# Altium project GargantuRAM_1_5_PRE_GITHUB.PrjPcb (part 1 of 3)
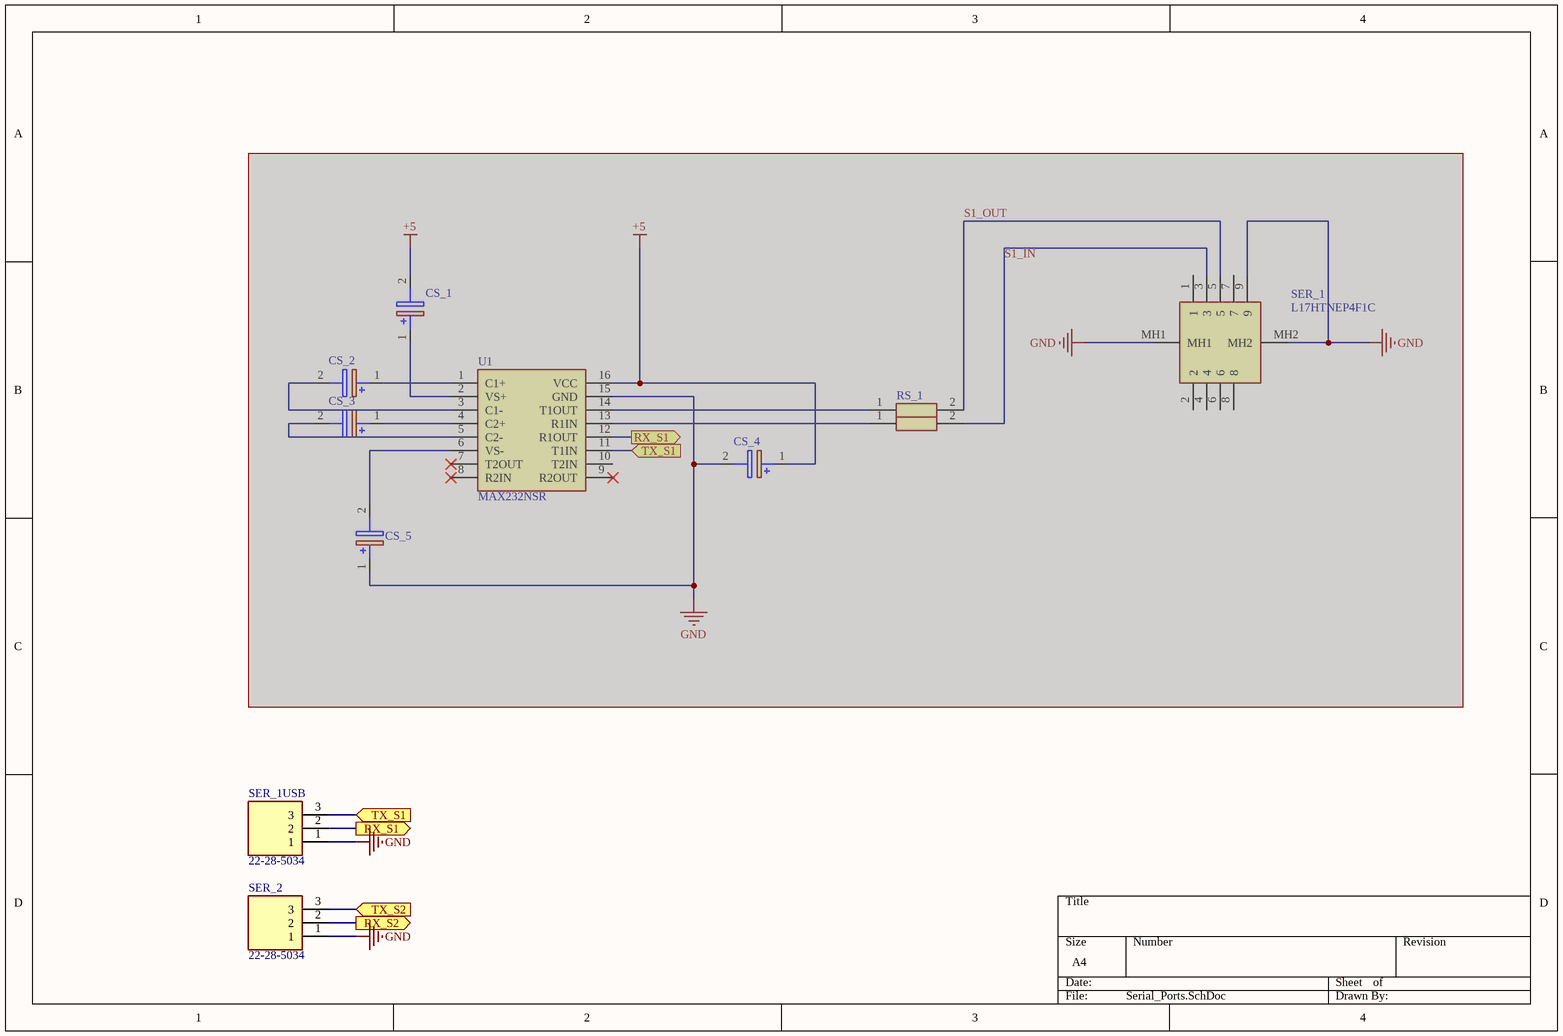
[diagram p0: Serial_Ports.SchDoc]
11 sheets, 300 parts. Net scope: flat (ports and power ports of the same name join across sheets).
Board file: MainBoard_6_layers.PcbDoc
Sheets:
  Serial_Ports.SchDoc
  ROM.SchDoc
  Power.SchDoc
  Ethernet.SchDoc
  CPU_and_EXPANSION_BUS.SchDoc
  SD_RTC_SPI.SchDoc
  RAM.SchDoc
  FPGA.SchDoc
  AddressBUS.SchDoc
  Clock.SchDoc
  DataBUS.SchDoc

## Sheet Serial_Ports.SchDoc
size A4; SheetNumber: 1; SheetTotal: 12

### Parts
CS_1  EDH105M050A9BAA  [CAPAE430X565N]  (value not drawn)  (masked out: inside a compile mask, not in the netlist)
CS_2  EDH105M050A9BAA  [CAPAE430X565N]  (value not drawn)  (masked out: inside a compile mask, not in the netlist)
CS_3  EDH105M050A9BAA  [CAPAE430X565N]  (value not drawn)  (masked out: inside a compile mask, not in the netlist)
CS_4  EDH105M050A9BAA  [CAPAE430X565N]  (value not drawn)  (masked out: inside a compile mask, not in the netlist)
CS_5  EDH105M050A9BAA  [CAPAE430X565N]  (value not drawn)  (masked out: inside a compile mask, not in the netlist)
RS_1  RCC0805100RFKEA  [RCC0805_e3]  (value not drawn)  (masked out: inside a compile mask, not in the netlist)
RS_2  RCC0805100RFKEA  [RCC0805_e3]  (value not drawn)  (masked out: inside a compile mask, not in the netlist)
SER_1  L17HTNEP4F1C  [L17HTNEP4F1C]  (masked out: inside a compile mask, not in the netlist)
SER_1USB  22-28-5034  [HDRV3W66P0X254_1X3_1016X249X1042P]
SER_2  22-28-5034  [HDRV3W66P0X254_1X3_1016X249X1042P]
U1  MAX232NSR  [SOIC127P780X200-16N]  (masked out: inside a compile mask, not in the netlist)

### Ports
RX_S1 (out), RX_S2 (out), TX_S1 (in), TX_S2 (in)

### Nets
GND: SER_1USB.1 SER_2.1
RX_S1: SER_1USB.2 ; port RX_S1
RX_S2: SER_2.2 ; port RX_S2
TX_S1: SER_1USB.3 ; port TX_S1
TX_S2: SER_2.3 ; port TX_S2

### Library data of the parts
CS_1-CS_5 = EDH105M050A9BAA: Capacitor Polarised; Manufacturer_Name: KEMET; Datasheet Link: https://content.kemet.com/datasheets/KEM_A4049_EDH.pdf; Height: 5.65mm; Manufacturer_Part_Number: EDH105M050A9BAA; Mouser Part Number: 80-EDH105M050A9BAA; Mouser Price/Stock: https://www.mouser.co.uk/ProductDetail/KEMET/EDH105M050A9BAA?qs=E9QF1UCAUX56DBSFGzxVeg%3D%3D; Arrow Part Number: EDH105M050A9BAA; Arrow Price/Stock: https://www.arrow.com/en/products/edh105m050a9baa/kemet-corporation?region=europe
RS_1 RS_2 = RCC0805100RFKEA: Resistor; Manufacturer_Name: Vishay; Datasheet Link: https://www.vishay.com/docs/20066/rcce3.pdf; Height: 0.5mm; Manufacturer_Part_Number: RCC0805100RFKEA; Mouser Part Number: 71-RCC0805100RFKEA; Mouser Price/Stock: https://www.mouser.co.uk/ProductDetail/Vishay-Dale/RCC0805100RFKEA?qs=GedFDFLaBXHpeG221Izd5g%3D%3D; Arrow Part Number: RCC0805100RFKEA; Arrow Price/Stock: https://www.arrow.com/en/products/rcc0805100rfkea/vishay?region=nac
SER_1 = L17HTNEP4F1C: Connector; Manufacturer_Name: Amphenol Communications Solutions; Datasheet Link: https://cdn.amphenol-cs.com/media/wysiwyg/files/drawing/l17htnxp4fxc.pdf; Height: 12.55mm; Manufacturer_Part_Number: L17HTNEP4F1C; Mouser Part Number: 523-L17HTNEP4F1C; Mouser Price/Stock: https://www.mouser.co.uk/ProductDetail/Amphenol-Commercial-Products/L17HTNEP4F1C?qs=U9AFyCBc0MwQlSlNY0N8tQ%3D%3D
SER_1USB SER_2 = 22-28-5034: Connector; Manufacturer_Name: Molex; Datasheet Link: https://componentsearchengine.com/Datasheets/2/22-28-5034.pdf; Height: 10.42mm; Manufacturer_Part_Number: 22-28-5034; Mouser Part Number: 538-22-28-5034; Mouser Price/Stock: https://www.mouser.co.uk/ProductDetail/Molex/22-28-5034?qs=l%252BWx29wYPrxAp9jaws3tbA%3D%3D
U1 = MAX232NSR: Integrated Circuit; Manufacturer_Name: Texas Instruments; Datasheet Link: http://www.ti.com/general/docs/lit/getliterature.tsp?genericPartNumber=MAX232&fileType=pdf&HQS=ti-null-null-sf-df-pf-sep-wwe&DCM=yes; Height: 2mm; Manufacturer_Part_Number: MAX232NSR; Mouser Part Number: 595-MAX232NSR; Mouser Price/Stock: https://www.mouser.co.uk/ProductDetail/Texas-Instruments/MAX232NSR?qs=paYhMW8qfiuOrkdV8Ubirw%3D%3D; Arrow Part Number: MAX232NSR; Arrow Price/Stock: https://www.arrow.com/en/products/max232nsr/texas-instruments?region=nac

## Sheet ROM.SchDoc
size A4; SheetNumber: 2; SheetTotal: 11
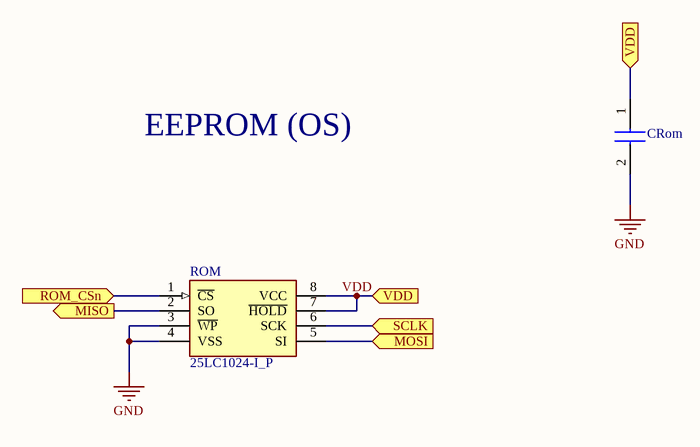
[diagram p1: ROM.SchDoc]

### Parts
CRom  GRM155R71C104JA88D  [CAPC1005X55N]  (value not drawn)
ROM  25LC1024-I_P  [DIP781W56P254L950H533Q8N]

### Ports
MISO (out), MOSI (in), ROM_CSn (in), SCLK (in), VDD (in)

### Nets
GND: CRom.2 ROM.3(~{WP}) ROM.4(VSS)
MISO: ROM.2(SO) ; port MISO
MOSI: ROM.5(SI) ; port MOSI
ROM_CSn: ROM.1(~{CS}) ; port ROM_CSn
SCLK: ROM.6(SCK) ; port SCLK
VDD: CRom.1 ROM.7(~{HOLD}) ROM.8(VCC) ; port VDD

### Notes on the sheet
- EEPROM (OS)

### Library data of the parts
CRom = GRM155R71C104JA88D: Capacitor; Manufacturer_Name: Murata Electronics; Datasheet Link: http://www.murata.com/~/media/webrenewal/support/library/catalog/products/capacitor/mlcc/c02e.pdf; Height: 0.55mm; Manufacturer_Part_Number: GRM155R71C104JA88D; Mouser Part Number: 81-GRM155R71C104JA8D; Mouser Price/Stock: https://www.mouser.co.uk/ProductDetail/Murata-Electronics/GRM155R71C104JA88D?qs=pwh76yelNxDjPOceoz6xEg%3D%3D; Arrow Part Number: GRM155R71C104JA88D; Arrow Price/Stock: https://www.arrow.com/en/products/grm155r71c104ja88d/murata-manufacturing?region=nac
ROM = 25LC1024-I_P: Integrated Circuit; Manufacturer_Name: Microchip; Manufacturer_Part_Number: 25LC1024-I/P; Datasheet Link: http://ww1.microchip.com/downloads/en/DeviceDoc/22064D.pdf; Height: 5.334mm; Mouser Part Number: 579-25LC1024-I/P; Mouser Price/Stock: https://www.mouser.co.uk/ProductDetail/Microchip-Technology/25LC1024-I-P?qs=W2ndVjZwIII4HC8C0OcyMA%3D%3D; Arrow Part Number: 25LC1024-I/P; Arrow Price/Stock: https://www.arrow.com/en/products/25lc1024-ip/microchip-technology

## Sheet Power.SchDoc
size A3; SheetNumber: 3; SheetTotal: 12
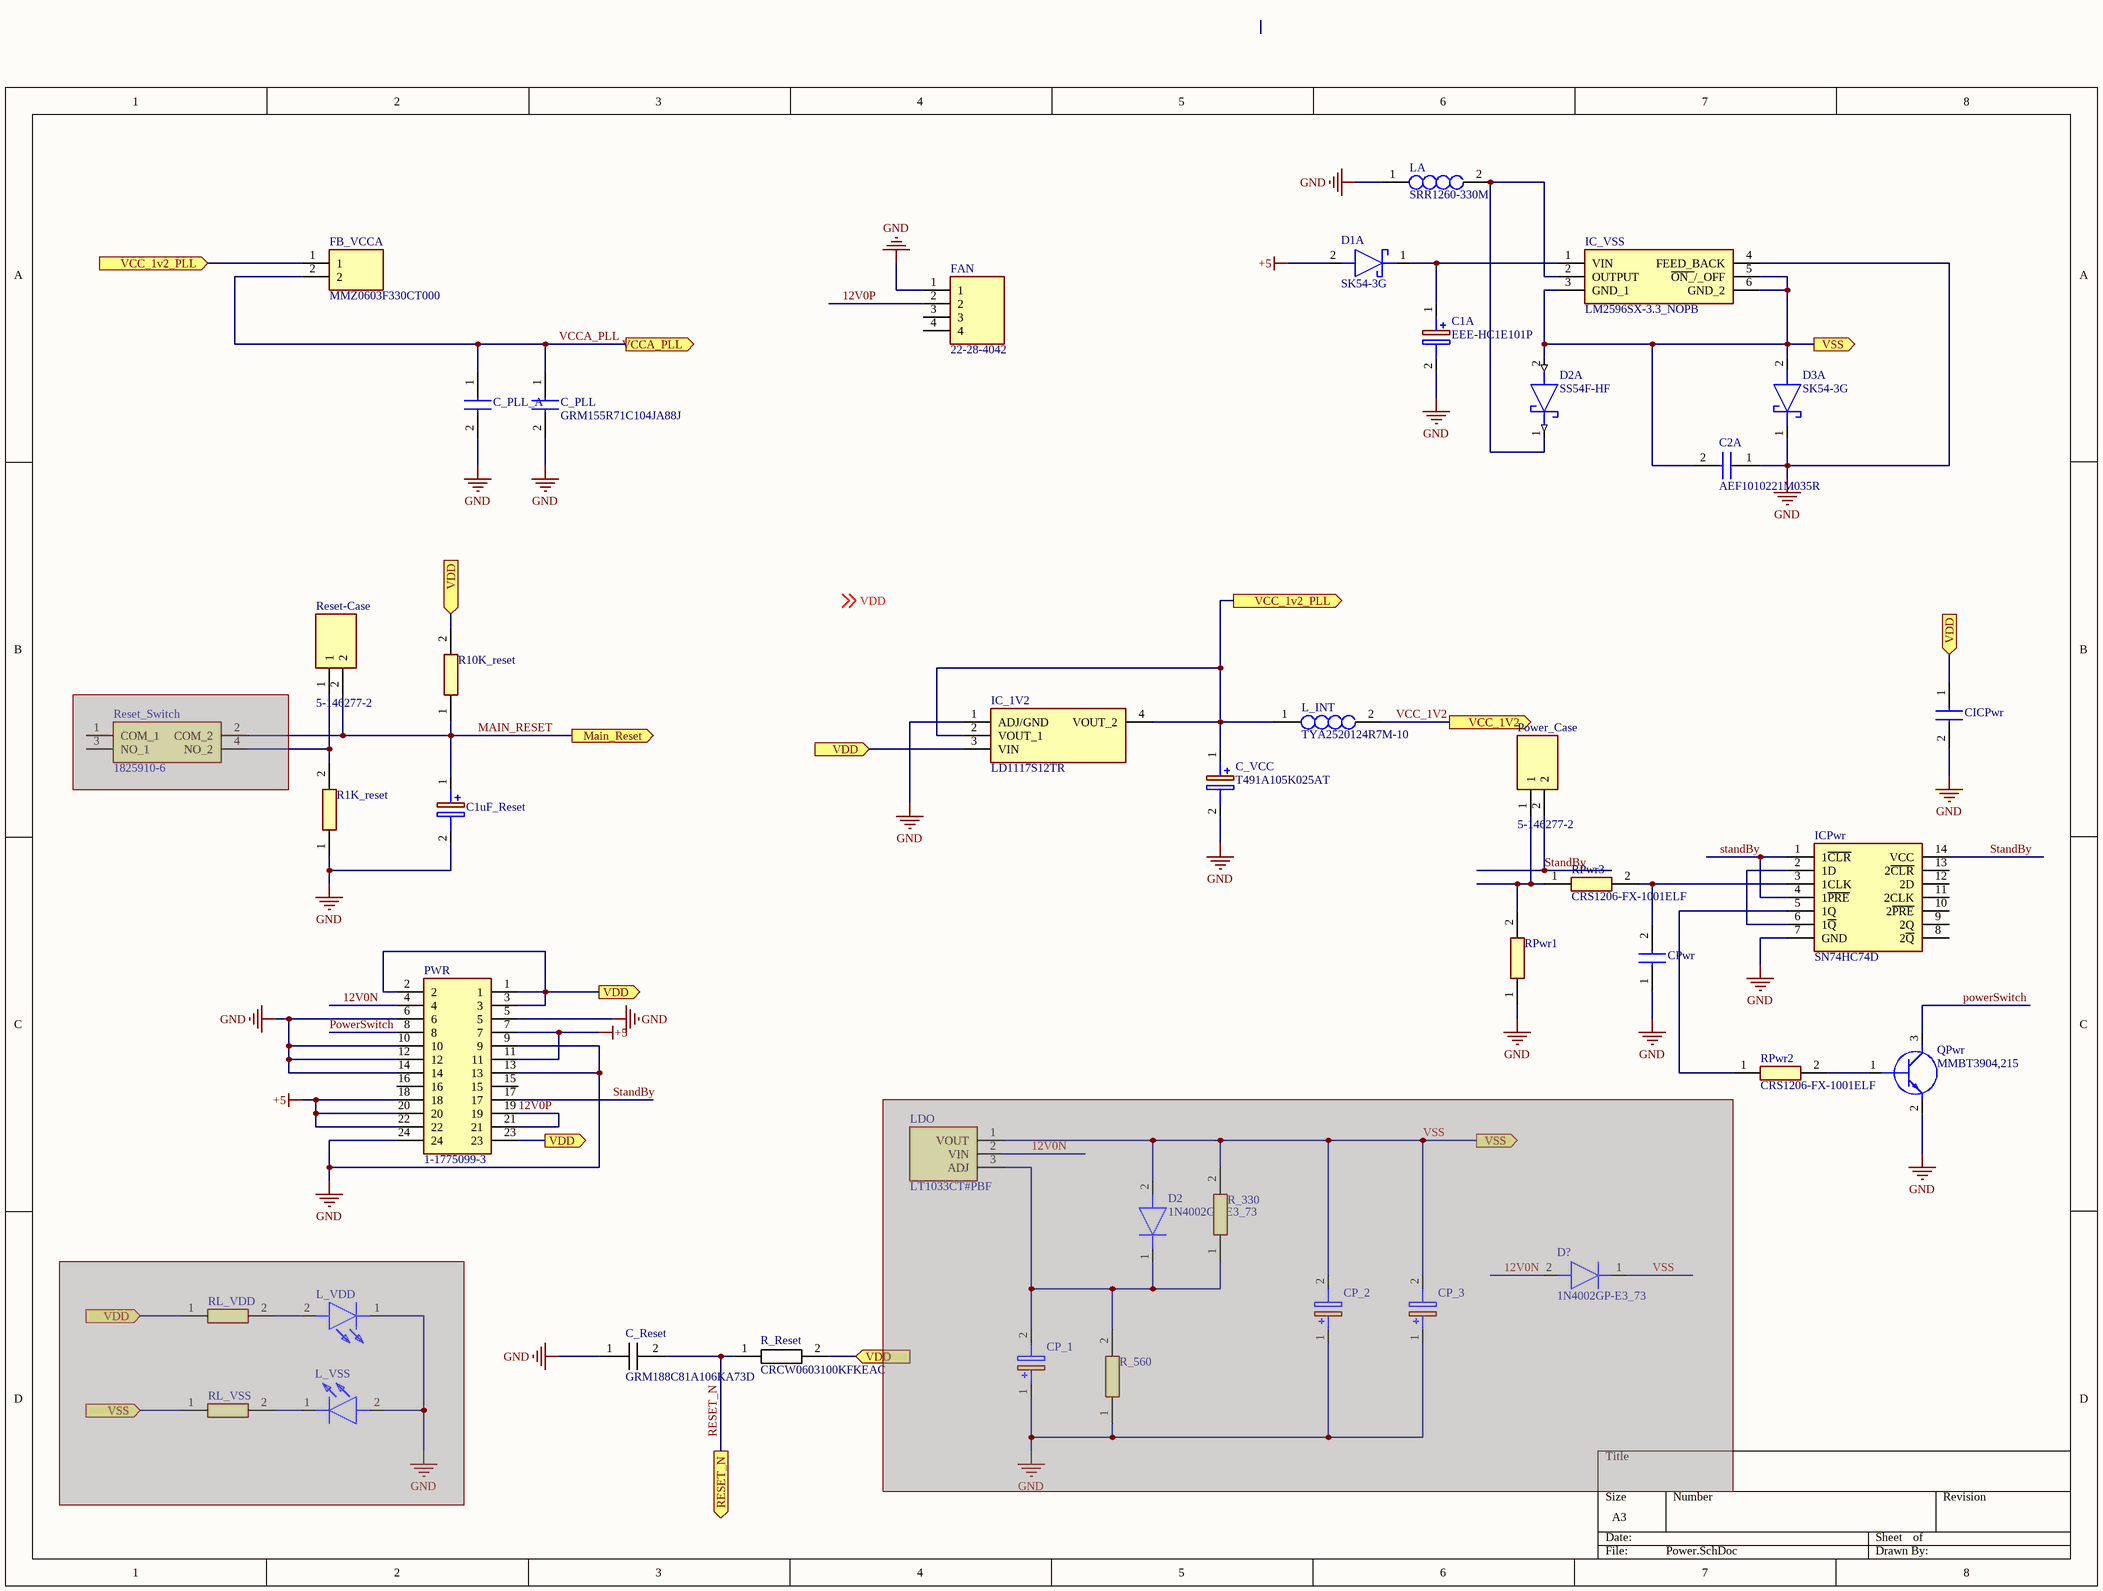
[diagram p2: Power.SchDoc]

### Parts
C1A  EEE-HC1E101P  [EEHZT1E331UP]
C1uF_Reset  EDH105M050A9BAA  [CAPAE430X565N]  (value not drawn)
C2A  AEF1010221M035R  [CAPAE1030X1050N]
C_PLL  GRM155R71C104JA88J  [CAPC1005X55N]
C_PLL_A  C0805X475J3RACAUTO7210  [CAPC2012X145N]  (value not drawn)
C_Reset  GRM188C81A106KA73D  [CAPC1608X90N]
C_VCC  T491A105K025AT  [T491A]
CICPwr  GRM155R71C104JA88D  [CAPC1005X55N]  (value not drawn)
CP_1  860020472003  [CAPPRD200W52D500H1250]  (value not drawn)  (masked out: inside a compile mask, not in the netlist)
CP_2  TAP225K035CRW  [TAP225K035CRW]  (value not drawn)  (masked out: inside a compile mask, not in the netlist)
CP_3  ECA-1EM102  [CAPPRD500W65D1025H2200]  (value not drawn)  (masked out: inside a compile mask, not in the netlist)
CPwr  C0603X103G5JACTU  [C0603]  (value not drawn)
D1A  SK54-3G  [DIOM5437X240N]
D2  1N4002GP-E3_73  [DIOAD1405W86L465D235]  (masked out: inside a compile mask, not in the netlist)
D2A  SS54F-HF  [SODFL4626X120N]
D3A  SK54-3G  [DIOM5437X240N]
D?  1N4002GP-E3_73  [DIOAD1405W86L465D235]  (masked out: inside a compile mask, not in the netlist)
FAN  22-28-4042  [HDRV4W66P0X254_1X4_1016X249X1003P]
FB_VCCA  MMZ0603F330CT000  [BEADC0603X33N]
IC_1V2  LD1117S12TR  [SOT230P700X180-4N]
IC_VSS  LM2596SX-3.3_NOPB  [KTT0005B]
ICPwr  SN74HC74D  [SOIC127P600X175-14N]
L_INT  TYA2520124R7M-10  [TYA2520124R7M10]
L_VDD  150060VS55040  [LEDM168X50N]  (value not drawn)  (masked out: inside a compile mask, not in the netlist)
L_VSS  150060SS75003  [150060SS75003]  (value not drawn)  (masked out: inside a compile mask, not in the netlist)
LA  SRR1260-330M  [SRR1260-150M]
LDO  LT1033CT#PBF  [TO254P457X1022X2266-3P]  (masked out: inside a compile mask, not in the netlist)
Power_Case  5-146277-2  [HDRV2W67P0X254_1X2_467X234X823P]
PWR  1-1775099-3  [1-1775099-3]
QPwr  MMBT3904,215  [MMBT3904215]
R1K_reset  RCS06031K00FKEA  [RESC1608X50N]  (value not drawn)
R10K_reset  RCS060310K0JNEA  [RCS0603_E3]  (value not drawn)
R_330  OK3315E-R52  [RESAD1680W64L680D250]  (value not drawn)  (masked out: inside a compile mask, not in the netlist)
R_560  OK5615E-R52  [RESAD1680W64L680D250]  (value not drawn)  (masked out: inside a compile mask, not in the netlist)
R_Reset  CRCW0603100KFKEAC  [RESC1608X55N]
Reset-Case  5-146277-2  [HDRV2W67P0X254_1X2_467X234X823P]
Reset_Switch  1825910-6  [18259106]  (masked out: inside a compile mask, not in the netlist)
RL_VDD  CRCW06031K00JNEAC  [RESC1608X55N]  (value not drawn)  (masked out: inside a compile mask, not in the netlist)
RL_VSS  CRCW06031K00JNEAC  [RESC1608X55N]  (value not drawn)  (masked out: inside a compile mask, not in the netlist)
RPwr1  CRS1206QFX-1002ELF  [RESC3116X65N]  (value not drawn)
RPwr2  CRS1206-FX-1001ELF  [RESC3116X65N]
RPwr3  CRS1206-FX-1001ELF  [RESC3116X65N]

### Ports
Main_Reset (out), RESET_N (out), VCC_1V2 (out), VCC_1v2_PLL (in), VCC_1v2_PLL (out), VCCA_PLL (out), VDD (in), VDD (out), VSS (in), VSS (out)

### Nets
+5: D1A.2(A) PWR.7 PWR.11 PWR.18 PWR.20 PWR.22
GND: C1A.2(-) C1uF_Reset.2(-) C2A.1(+) C_PLL.2 C_PLL_A.2 C_Reset.1 C_VCC.2(-) CICPwr.2 CPwr.1 D3A.1(K) FAN.1 IC_1V2.1(ADJ/GND) IC_VSS.4(FEED_BACK) ICPwr.7(GND) LA.1 PWR.5 PWR.6 PWR.9 PWR.10 PWR.12 PWR.13 PWR.14 PWR.24 QPwr.2(E) R1K_reset.1 RPwr1.1
12V0N: PWR.4
12V0P: FAN.2 PWR.19 PWR.21
MAIN_RESET: C1uF_Reset.1(+) R10K_reset.1 Reset-Case.2 ; port Main_Reset
PowerSwitch: PWR.8 QPwr.3(C)
RESET_N: C_Reset.2 R_Reset.1 ; port RESET_N
StandBy: ICPwr.1(1~{CLR}) ICPwr.4(1~{PRE}) ICPwr.14(VCC) Power_Case.2 PWR.17
VCC_1V2: L_INT.2 ; port VCC_1V2
VCCA_PLL: C_PLL.1 C_PLL_A.1 FB_VCCA.2 ; port VCCA_PLL
VDD: CICPwr.1 IC_1V2.3(VIN) PWR.1 PWR.2 PWR.3 PWR.23 R10K_reset.2 R_Reset.2 ; port VDD
VSS: C2A.2(-) D2A.2(A) D3A.2(A) IC_VSS.3(GND_1) IC_VSS.5(~{ON_}/_OFF) IC_VSS.6(GND_2) ; port VSS
NetC1A_1: C1A.1(+) D1A.1(K) IC_VSS.1(VIN)
NetC_VCC_1: C_VCC.1(+) FB_VCCA.1 IC_1V2.2(VOUT_1) IC_1V2.4(VOUT_2) L_INT.1 ; port VCC_1v2_PLL
NetCPwr_2: CPwr.2 ICPwr.3(1CLK) RPwr3.2
NetD2A_1: D2A.1(K) IC_VSS.2(OUTPUT) LA.2
NetICPwr_2: ICPwr.2(1D) ICPwr.6(1~{Q})
NetICPwr_5: ICPwr.5(1Q) RPwr2.1
NetPower_Case_1: Power_Case.1 RPwr1.2 RPwr3.1
NetQPwr_1: QPwr.1(B) RPwr2.2
NetR1K_reset_2: R1K_reset.2 Reset-Case.1

Not connected (* = marked no-connect by the designer): FAN 3 4; ICPwr 8(2~{Q}) 9(2Q) 10(2~{PRE}) 11(2CLK) 12(2D) 13(2~{CLR}); PWR 15 16

### Notes on the sheet
- Labels drawn without touching a wire or pin: VDD

### Library data of the parts
C1A = EEE-HC1E101P: Capacitor Polarised; Manufacturer_Name: Panasonic; Datasheet Link: http://industrial.panasonic.com/cdbs/www-data/pdf/RDE0000/ABA0000C1160.pdf; Height: 10.8mm; Manufacturer_Part_Number: EEE-HC1E101P; Mouser Part Number: 667-EEE-HC1E101P; Mouser Price/Stock: https://www.mouser.com/Search/Refine.aspx?Keyword=667-EEE-HC1E101P; Arrow Part Number: EEE-HC1E101P; Arrow Price/Stock: https://www.arrow.com/en/products/eee-hc1e101p/panasonic
C1uF_Reset = EDH105M050A9BAA: as CS_1 on sheet Serial_Ports; Datasheet Link: https://content.kemet.com/datasheets/KEM_A4049_EDH.pdf; Height: 5.65mm; Manufacturer_Part_Number: EDH105M050A9BAA; Mouser Part Number: 80-EDH105M050A9BAA; Mouser Price/Stock: https://www.mouser.co.uk/ProductDetail/KEMET/EDH105M050A9BAA?qs=E9QF1UCAUX56DBSFGzxVeg%3D%3D; Arrow Part Number: EDH105M050A9BAA; Arrow Price/Stock: https://www.arrow.com/en/products/edh105m050a9baa/kemet-corporation?region=europe
C2A = AEF1010221M035R: Capacitor; Manufacturer_Name: Kyocera AVX; Datasheet Link: https://br.mouser.com/datasheet/2/40/kyocera_avx_aef_series-2933561.pdf; Height: 10.5mm; Manufacturer_Part_Number: AEF1010221M035R
C_PLL = GRM155R71C104JA88J: Capacitor; Manufacturer_Name: Murata Electronics; Datasheet Link: http://www.murata.com/~/media/webrenewal/support/library/catalog/products/capacitor/mlcc/c02e.pdf; Height: 0.55mm; Manufacturer_Part_Number: GRM155R71C104JA88J; Mouser Part Number: 81-GRM155R71C104JA8J; Mouser Price/Stock: https://www.mouser.co.uk/ProductDetail/Murata-Electronics/GRM155R71C104JA88J?qs=hNud%2FORuBR1FShEh%252B0yzMw%3D%3D; Arrow Part Number: GRM155R71C104JA88J; Arrow Price/Stock: https://www.arrow.com/en/products/grm155r71c104ja88j/murata-manufacturing?region=nac
C_PLL_A = C0805X475J3RACAUTO7210: Capacitor; Manufacturer_Name: KEMET; Datasheet Link: https://www.kemet.com/specsheet/C0805X475J3RACAUTO7210; Height: 1.45mm; Manufacturer_Part_Number: C0805X475J3RACAUTO7210; Mouser Part Number: 80-C0805X475J3RAUTLR; Mouser Price/Stock: https://www.mouser.co.uk/ProductDetail/KEMET/C0805X475J3RACAUTO7210?qs=%252B6g0mu59x7KZNSFSYLExgg%3D%3D
C_Reset = GRM188C81A106KA73D: Capacitor; Manufacturer_Name: Murata Electronics; Datasheet Link: http://componentsearchengine.com/Datasheets/1/GRM188C81A106KA73D.pdf; Height: 0.9mm; Manufacturer_Part_Number: GRM188C81A106KA73D; Mouser Part Number: 81-GRM188C81A106KA3D; Mouser Price/Stock: https://www.mouser.com/Search/Refine.aspx?Keyword=81-GRM188C81A106KA3D; Arrow Part Number: GRM188C81A106KA73D; Arrow Price/Stock: https://www.arrow.com/en/products/grm188c81a106ka73d/murata-manufacturing
C_VCC = T491A105K025AT: Capacitor Polarised; Manufacturer_Name: KEMET; Datasheet Link: https://content.kemet.com/datasheets/KEM_T2005_T491.pdf; Height: 1.8mm; Manufacturer_Part_Number: T491A105K025AT; Mouser Part Number: 80-T491A105K025; Mouser Price/Stock: https://www.mouser.co.uk/ProductDetail/KEMET/T491A105K025AT?qs=VCf6WUQjPgGa9NtfaqeN%252Bg%3D%3D; Arrow Part Number: T491A105K025AT; Arrow Price/Stock: https://www.arrow.com/en/products/t491a105k025at/kemet-corporation?region=nac
CICPwr = GRM155R71C104JA88D: as CRom on sheet ROM; Datasheet Link: http://www.murata.com/~/media/webrenewal/support/library/catalog/products/capacitor/mlcc/c02e.pdf; Height: 0.55mm; Manufacturer_Part_Number: GRM155R71C104JA88D; Mouser Part Number: 81-GRM155R71C104JA8D; Mouser Price/Stock: https://www.mouser.co.uk/ProductDetail/Murata-Electronics/GRM155R71C104JA88D?qs=pwh76yelNxDjPOceoz6xEg%3D%3D; Arrow Part Number: GRM155R71C104JA88D; Arrow Price/Stock: https://www.arrow.com/en/products/grm155r71c104ja88d/murata-manufacturing?region=nac
CP_1 = 860020472003: Capacitor Polarised; Manufacturer_Name: Wurth Elektronik; Datasheet Link: https://katalog.we-online.com/pbs/datasheet/860020472003.pdf; Height: 12.5mm; Manufacturer_Part_Number: 860020472003; Mouser Part Number: 710-860020472003; Mouser Price/Stock: https://www.mouser.co.uk/ProductDetail/Wurth-Elektronik/860020472003?qs=0KOYDY2FL2800BT4CoOrXQ%3D%3D
CP_2 = TAP225K035CRW: Capacitor Polarised; Manufacturer_Name: AVX; Datasheet Link: https://datasheets.kyocera-avx.com/tap.pdf; Height: 9mm; Manufacturer_Part_Number: TAP225K035CRW
CP_3 = ECA-1EM102: Capacitor Polarised; Manufacturer_Name: Panasonic; Datasheet Link: http://industrial.panasonic.com/cdbs/www-data/pdf/RDF0000/ABA0000C1218.pdf; Height: 22mm; Manufacturer_Part_Number: ECA-1EM102; Mouser Part Number: 667-ECA-1EM102; Mouser Price/Stock: https://www.mouser.com/Search/Refine.aspx?Keyword=667-ECA-1EM102
CPwr = C0603X103G5JACTU: Capacitor; Manufacturer_Name: KEMET; Datasheet Link: https://content.kemet.com/datasheets/KEM_C1087_U2J_FT-CAP_SMD.pdf; Height: 0.87mm; Manufacturer_Part_Number: C0603X103G5JACTU; Mouser Part Number: 80-C0603X103G5J; Mouser Price/Stock: https://www.mouser.co.uk/ProductDetail/KEMET/C0603X103G5JACTU/?qs=rKqJIm0tnYFz51SLsN%252BFYQ%3D%3D; Arrow Part Number: C0603X103G5JACTU; Arrow Price/Stock: https://www.arrow.com/en/products/c0603x103g5jactu/kemet-corporation
D1A D3A = SK54-3G: Schottky Diode; Manufacturer_Name: Diotec; Datasheet Link: https://diotec.com/request/datasheet/sk54-3g.pdf; Height: 2.4mm; Manufacturer_Part_Number: SK54-3G; Mouser Part Number: 637-SK54-3G; Mouser Price/Stock: https://www.mouser.co.uk/ProductDetail/Diotec-Semiconductor/SK54-3G?qs=OlC7AqGiEDkfzpeKJrtneQ%3D%3D; Arrow Part Number: SK54-3G; Arrow Price/Stock: https://www.arrow.com/en/products/sk54-3g/diotec-semiconductor-ag?region=asia
D2 D? = 1N4002GP-E3_73: Diode; Manufacturer_Name: Vishay; Manufacturer_Part_Number: 1N4002GP-E3/73; Datasheet Link: https://www.arrow.com/en/products/1n4002gp-e373/vishay; Mouser Part Number: 625-1N4002GP-E3/73; Mouser Price/Stock: https://www.mouser.co.uk/ProductDetail/Vishay-General-Semiconductor/1N4002GP-E3-73?qs=N4vtoAxH%2FSqHH%252BCA02W8mw%3D%3D; Arrow Part Number: 1N4002GP-E3/73; Arrow Price/Stock: https://www.arrow.com/en/products/1n4002gp-e373/vishay
D2A = SS54F-HF: Schottky Diode; Manufacturer_Name: Comchip Technology; Datasheet Link: http://www.comchiptech.com/admin/files/product/20190806174558.pdf; Height: 1.2mm; Manufacturer_Part_Number: SS54F-HF; Mouser Part Number: 750-SS54F-HF; Mouser Price/Stock: https://www.mouser.co.uk/ProductDetail/Comchip-Technology/SS54F-HF?qs=GBLSl2Akirv9e2Io%252BmNS2w%3D%3D; Arrow Part Number: SS54F-HF; Arrow Price/Stock: https://www.arrow.com/en/products/ss54f-hf/comchip-technology?region=nac
FAN = 22-28-4042: Connector; Manufacturer_Name: Molex; Datasheet Link: https://www.molex.com/content/dam/molex/molex-dot-com/products/automated/en-us/salesdrawingpdf/423/42375/022284042_sd.pdf?inline; Height: 10.03mm; Manufacturer_Part_Number: 22-28-4042; Mouser Part Number: 538-22-28-4042; Mouser Price/Stock: https://www.mouser.co.uk/ProductDetail/Molex/22-28-4042?qs=GAPJcf4kvdu6DqYOOlzdaQ%3D%3D
FB_VCCA = MMZ0603F330CT000: Ferrite Bead; Manufacturer_Name: TDK; Datasheet Link: https://product.tdk.com/system/files/dam/doc/product/emc/emc/beads/catalog/beads_commercial_signal_mmz0603_en.pdf; Height: 0.33mm; Manufacturer_Part_Number: MMZ0603F330CT000; Mouser Part Number: 810-MMZ0603F330CT000; Mouser Price/Stock: https://www.mouser.co.uk/ProductDetail/TDK/MMZ0603F330CT000?qs=8Kz9Wu9QwqXBIC8npmRUAg%3D%3D
IC_1V2 = LD1117S12TR: Integrated Circuit; Manufacturer_Name: STMicroelectronics; Datasheet Link: http://www.st.com/st-web-ui/static/active/en/resource/technical/document/datasheet/CD00000544.pdf; Height: 1.8mm; Manufacturer_Part_Number: LD1117S12TR; Mouser Part Number: 511-LD1117S12; Mouser Price/Stock: https://www.mouser.co.uk/ProductDetail/STMicroelectronics/LD1117S12TR?qs=61zNq1xPlVSs7%252BqGq4VslA%3D%3D; Arrow Part Number: LD1117S12TR; Arrow Price/Stock: https://www.arrow.com/en/products/ld1117s12tr/stmicroelectronics?region=nac
IC_VSS = LM2596SX-3.3_NOPB: Integrated Circuit; Manufacturer_Name: Texas Instruments; Manufacturer_Part_Number: LM2596SX-3.3/NOPB; Datasheet Link: http://www.ti.com/lit/gpn/lm2596; Mouser Part Number: 926-LM2596SX33NOPB; Mouser Price/Stock: https://www.mouser.co.uk/ProductDetail/Texas-Instruments/LM2596SX-3.3-NOPB?qs=X1J7HmVL2ZEm4UYTFC0WWA%3D%3D; Arrow Part Number: LM2596SX-3.3/NOPB; Arrow Price/Stock: https://www.arrow.com/en/products/lm2596sx-3.3nopb/texas-instruments?utm_currency=USD&region=nac
ICPwr = SN74HC74D: Integrated Circuit; Manufacturer_Name: Texas Instruments; Datasheet Link: http://www.ti.com/lit/gpn/sn74hc74; Height: 1.75mm; Manufacturer_Part_Number: SN74HC74D; Mouser Part Number: 595-SN74HC74D; Mouser Price/Stock: https://www.mouser.co.uk/ProductDetail/Texas-Instruments/SN74HC74D?qs=p6YqzpSxLIzsMi9OHpAhoA%3D%3D; Arrow Part Number: SN74HC74D; Arrow Price/Stock: https://www.arrow.com/en/products/sn74hc74d/texas-instruments?region=nac
L_INT = TYA2520124R7M-10: Inductor; Manufacturer_Name: Laird Performance Materials; Datasheet Link: https://www.mouser.com/datasheet/2/987/TYA252012_series_(Rev_A)-1864563.pdf; Height: 1.35mm; Manufacturer_Part_Number: TYA2520124R7M-10; Mouser Part Number: 739-TYA2520124R7M-10; Mouser Price/Stock: https://www.mouser.co.uk/ProductDetail/Laird-Performance-Materials/TYA2520124R7M-10?qs=sPbYRqrBIVn5urejTQMtvg%3D%3D
L_VDD = 150060VS55040: LED; Manufacturer_Name: Wurth Elektronik; Datasheet Link: https://katalog.we-online.com/led/datasheet/150060VS55040.pdf; Height: 0.5mm; Manufacturer_Part_Number: 150060VS55040; Mouser Part Number: 710-150060VS55040; Mouser Price/Stock: https://www.mouser.co.uk/ProductDetail/Wurth-Elektronik/150060VS55040?qs=8Aam6%252B7C6HEumg%252B0cJZzvA%3D%3D
L_VSS = 150060SS75003: LED; Manufacturer_Name: Wurth Elektronik; Datasheet Link: https://www.we-online.com/catalog/datasheet/150060SS75003.pdf; Height: 0.8mm; Manufacturer_Part_Number: 150060SS75003; Mouser Part Number: 710-150060SS75003; Mouser Price/Stock: https://www.mouser.co.uk/ProductDetail/Wurth-Elektronik/150060SS75003?qs=Li%252BoUPsLEntNiRmIe%252Bnzlg%3D%3D
LA = SRR1260-330M: Inductor; Manufacturer_Name: Bourns; Datasheet Link: https://www.bourns.com/docs/Product-Datasheets/SRR1260.pdf; Manufacturer_Part_Number: SRR1260-330M; Mouser Part Number: 652-SRR1260-330M; Mouser Price/Stock: https://www.mouser.co.uk/ProductDetail/Bourns/SRR1260-330M?qs=R2jSSvul3fC3V4%252BTrq0P0w%3D%3D; Arrow Part Number: SRR1260-330M; Arrow Price/Stock: https://www.arrow.com/en/products/srr1260-330m/bourns?utm_currency=USD&region=nac
LDO = LT1033CT#PBF: Integrated Circuit; Manufacturer_Name: Analog Devices; Datasheet Link: https://www.analog.com/media/en/technical-documentation/data-sheets/1033fd.pdf; Height: 4.572mm; Manufacturer_Part_Number: LT1033CT#PBF; Mouser Part Number: 584-LT1033CT#PBF; Mouser Price/Stock: https://www.mouser.com/Search/Refine.aspx?Keyword=584-LT1033CT%23PBF; Arrow Part Number: LT1033CT#PBF; Arrow Price/Stock: https://www.arrow.com/en/products/lt1033ctpbf/analog-devices
Power_Case Reset-Case = 5-146277-2: Connector; Manufacturer_Name: TE Connectivity; Datasheet Link: https://www.te.com/commerce/DocumentDelivery/DDEController?Action=srchrtrv&DocNm=146277&DocType=Customer+Drawing&DocLang=English; Height: 8.23mm; Manufacturer_Part_Number: 5-146277-2; Mouser Part Number: 571-5-146277-2; Mouser Price/Stock: https://www.mouser.co.uk/ProductDetail/TE-Connectivity/5-146277-2?qs=bwpFY26eRVdSYoepUea0uA%3D%3D; Arrow Part Number: 5-146277-2; Arrow Price/Stock: https://www.arrow.com/en/products/5-146277-2/te-connectivity?utm_currency=USD&region=nac
PWR = 1-1775099-3: Connector; Manufacturer_Name: TE Connectivity; Datasheet Link: http://www.te.com/commerce/DocumentDelivery/DDEController?Action=showdoc&DocId=Customer+Drawing%7F1775099%7FG%7Fpdf%7FEnglish%7FENG_CD_1775099_G.pdf%7F1-1775099-3; Manufacturer_Part_Number: 1-1775099-3; Mouser Part Number: 571-1-1775099-3; Mouser Price/Stock: https://www.mouser.co.uk/ProductDetail/TE-Connectivity/1-1775099-3?qs=28ld6GkVMjRzvehyCXdQkg%3D%3D; Arrow Part Number: 1-1775099-3; Arrow Price/Stock: https://www.arrow.com/en/products/1-1775099-3/te-connectivity?region=nac
QPwr = MMBT3904,215: Transistor BJT NPN; Manufacturer_Name: Nexperia; Datasheet Link: https://assets.nexperia.com/documents/data-sheet/MMBT3904.pdf; Height: 1.1mm; Manufacturer_Part_Number: MMBT3904,215; Mouser Part Number: 771-MMBT3904T/R; Mouser Price/Stock: https://www.mouser.co.uk/ProductDetail/Nexperia/MMBT3904215?qs=LOCUfHb8d9s%2FW6hzAJGDbw%3D%3D; Arrow Part Number: MMBT3904,215; Arrow Price/Stock: https://www.arrow.com/en/products/mmbt3904215/nexperia?utm_currency=USD&region=nac
R1K_reset = RCS06031K00FKEA: Resistor; Manufacturer_Name: Vishay; Datasheet Link: http://www.vishay.com/docs/20065/rcse3.pdf; Height: 0.5mm; Manufacturer_Part_Number: RCS06031K00FKEA; Mouser Part Number: 71-RCS06031K00FKEA; Mouser Price/Stock: https://www.mouser.co.uk/ProductDetail/Vishay-Dale/RCS06031K00FKEA?qs=NKmfXavxMaymZq%2F68Mdhcw%3D%3D; Arrow Part Number: RCS06031K00FKEA; Arrow Price/Stock: https://www.arrow.com/en/products/rcs06031k00fkea/vishay?region=nac
R10K_reset = RCS060310K0JNEA: Resistor; Manufacturer_Name: Vishay; Datasheet Link: https://www.vishay.com/docs/20065/rcse3.pdf; Manufacturer_Part_Number: RCS060310K0JNEA; Mouser Part Number: 71-RCS060310K0JNEA; Mouser Price/Stock: https://www.mouser.co.uk/ProductDetail/Vishay-Dale/RCS060310K0JNEA?qs=NKmfXavxMaxOSWu%252BIfGj8A%3D%3D; Arrow Part Number: RCS060310K0JNEA; Arrow Price/Stock: https://www.arrow.com/en/products/rcs060310k0jnea/vishay?region=nac
R_330 R_560 = OK3315E-R52: Resistor; Manufacturer_Name: Ohmite; Datasheet Link: https://www.alliedelec.com/m/d/7f961050c862e52d900c42b673f6b00a.pdf; Manufacturer_Part_Number: OK3315E-R52; Mouser Part Number: 588-OK3315E-R52; Mouser Price/Stock: https://www.mouser.co.uk/ProductDetail/Ohmite/OK3315E-R52?qs=AkUtuiJmyflNBr4QtOugqA%3D%3D
R_Reset = CRCW0603100KFKEAC: Resistor; Manufacturer_Name: Vishay; Datasheet Link: https://www.mouser.com/datasheet/2/427/crcwce3-1223726.pdf; Height: 0.55mm; Manufacturer_Part_Number: CRCW0603100KFKEAC; Mouser Part Number: 71-CRCW0603100KFKEAC; Mouser Price/Stock: https://www.mouser.co.uk/ProductDetail/Vishay-Dale/CRCW0603100KFKEAC?qs=E3Y5ESvWgWPxzfNYyMgX1w%3D%3D; Arrow Part Number: CRCW0603100KFKEAC; Arrow Price/Stock: https://www.arrow.com/en/products/crcw0603100kfkeac/vishay?region=nac
Reset_Switch = 1825910-6: Switch; Manufacturer_Name: TE Connectivity; Datasheet Link: https://www.te.com/commerce/DocumentDelivery/DDEController?Action=srchrtrv&DocNm=1825910&DocType=Customer+Drawing&DocLang=English&DocFormat=pdf&PartCntxt=1825910-6; Height: 5.3mm; Manufacturer_Part_Number: 1825910-6; Mouser Part Number: N/A; Mouser Price/Stock: https://www.mouser.co.uk/ProductDetail/TE-Connectivity/1825910-6?qs=A6cQTCBcXncisYDS1KbpGA%3D%3D; Arrow Part Number: 1825910-6; Arrow Price/Stock: https://www.arrow.com/en/products/1825910-6/te-connectivity?region=europe
RL_VDD RL_VSS = CRCW06031K00JNEAC: Resistor; Manufacturer_Name: Vishay; Datasheet Link: http://www.vishay.com/docs/28773/crcwce3.pdf; Height: 0.55mm; Manufacturer_Part_Number: CRCW06031K00JNEAC; Mouser Part Number: 71-CRCW06031K00JNEAC; Mouser Price/Stock: https://www.mouser.co.uk/ProductDetail/Vishay-Dale/CRCW06031K00JNEAC?qs=E3Y5ESvWgWPM5t3DlmyFHQ%3D%3D; Arrow Part Number: CRCW06031K00JNEAC; Arrow Price/Stock: https://www.arrow.com/en/products/crcw06031k00jneac/vishay?region=nac
RPwr1 = CRS1206QFX-1002ELF: Resistor; Manufacturer_Name: Bourns; Datasheet Link: http://www.bourns.com/docs/Product-Datasheets/CRS-Q.pdf; Height: 0.65mm; Manufacturer_Part_Number: CRS1206QFX-1002ELF; Mouser Part Number: 652-CRS1206QFX-1002E; Mouser Price/Stock: https://www.mouser.co.uk/ProductDetail/Bourns/CRS1206QFX-1002ELF?qs=8Wlm6%252BaMh8QKdvkWTPthtg%3D%3D; Arrow Part Number: CRS1206QFX-1002ELF; Arrow Price/Stock: https://www.arrow.com/en/products/crs1206qfx-1002elf/bourns?region=nac
RPwr2 RPwr3 = CRS1206-FX-1001ELF: Resistor; Manufacturer_Name: Bourns; Datasheet Link: http://uk.rs-online.com/web/p/products/8672962; Height: 0.65mm; Manufacturer_Part_Number: CRS1206-FX-1001ELF; Mouser Part Number: 652-CRS1206FX1001ELF; Mouser Price/Stock: https://www.mouser.co.uk/ProductDetail/Bourns/CRS1206-FX-1001ELF?qs=3ZbGupGMFUehf2oUUmM3wg%3D%3D; Arrow Part Number: CRS1206-FX-1001ELF; Arrow Price/Stock: https://www.arrow.com/en/products/crs1206-fx-1001elf/bourns?region=nac

## Sheet Ethernet.SchDoc
size A0; SheetNumber: 4; SheetTotal: 12
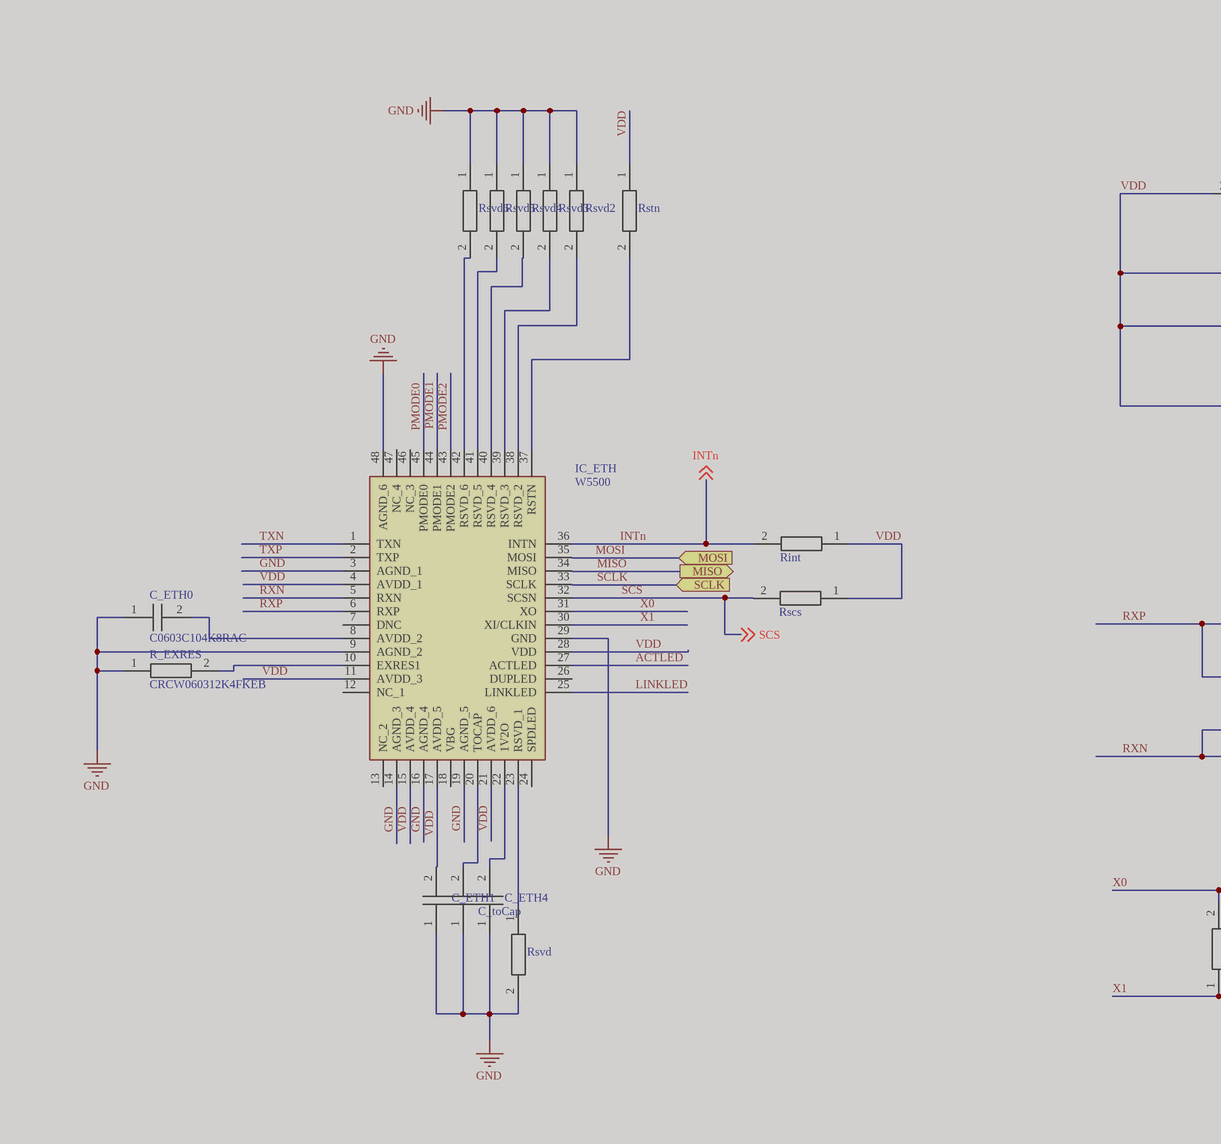
[diagram p3: Ethernet.SchDoc, left]
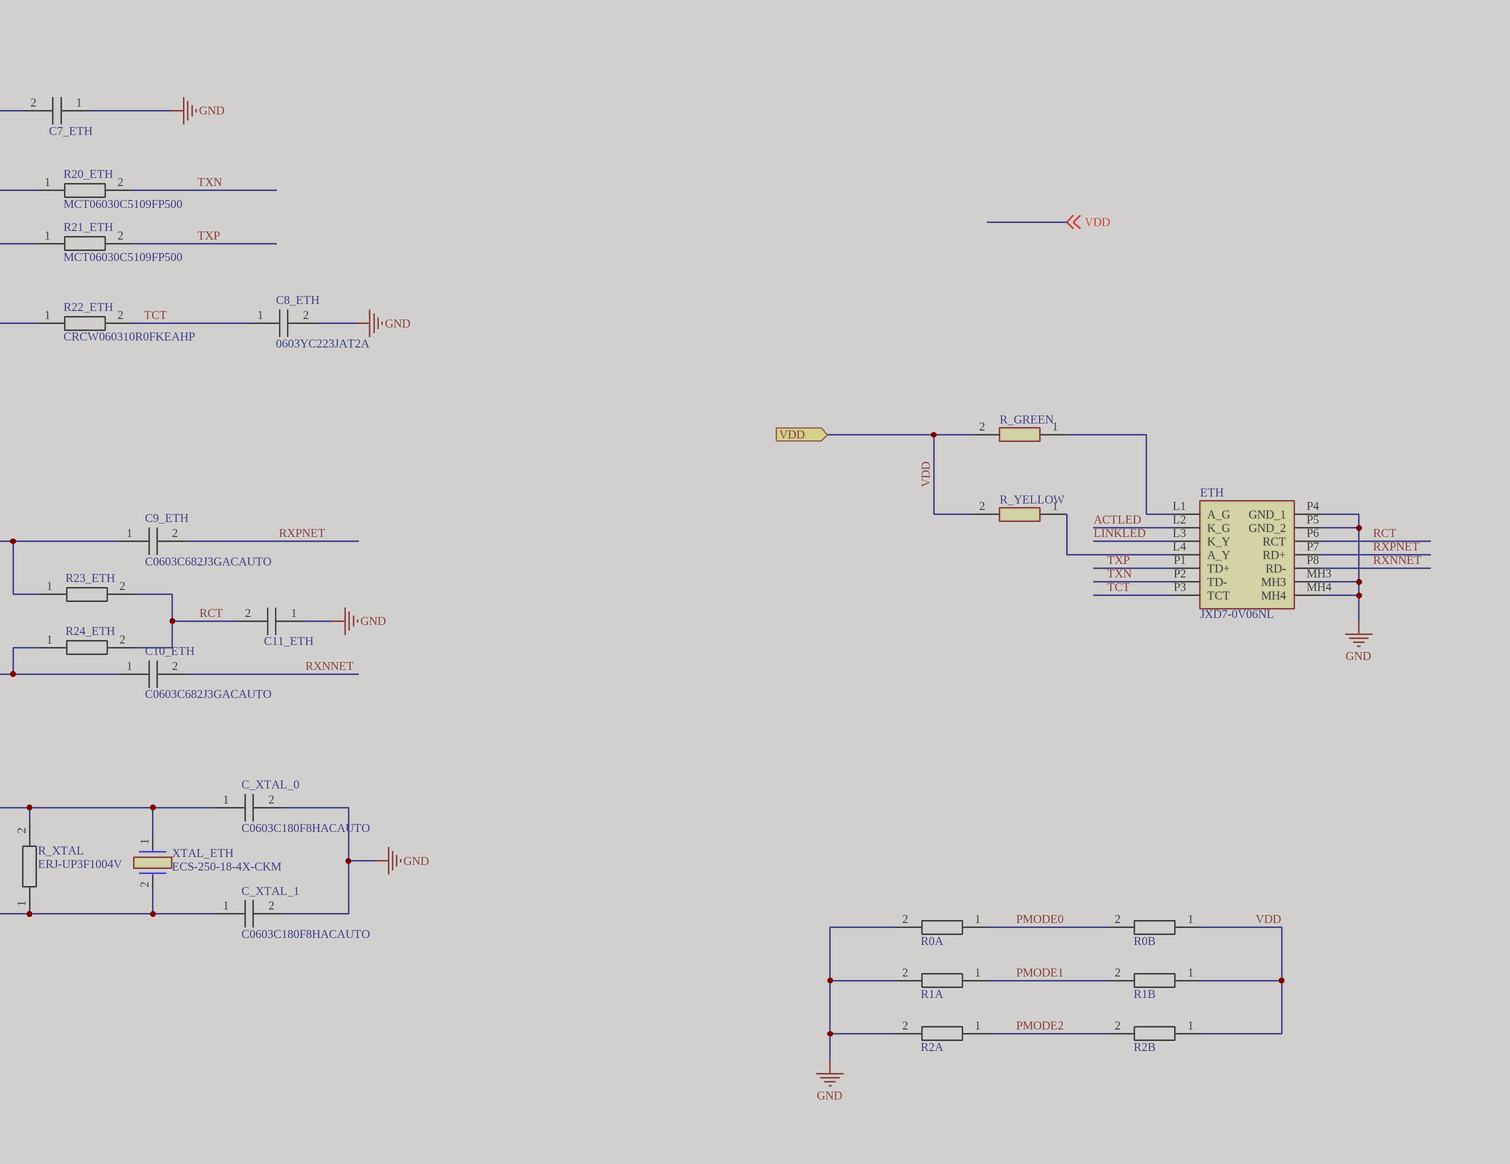
[diagram p4: Ethernet.SchDoc, right]

### Parts
C7_ETH  C0603C104K8RAC  [CAPC1608X95N]  (value not drawn)  (masked out: inside a compile mask, not in the netlist)
C8_ETH  0603YC223JAT2A  [CAPC1608X90N]  (masked out: inside a compile mask, not in the netlist)
C9_ETH  C0603C682J3GACAUTO  [C0603]  (masked out: inside a compile mask, not in the netlist)
C10_ETH  C0603C682J3GACAUTO  [C0603]  (masked out: inside a compile mask, not in the netlist)
C11_ETH  CGA3E2C0G1H103J080AA  [CAPC1608X90N]  (value not drawn)  (masked out: inside a compile mask, not in the netlist)
C_ETH0  C0603C104K8RAC  [CAPC1608X95N]  (masked out: inside a compile mask, not in the netlist)
C_ETH1  C0603C104K8RAC  [CAPC1608X95N]  (value not drawn)  (masked out: inside a compile mask, not in the netlist)
C_ETH4  CGA3E2C0G1H103J080AA  [CAPC1608X90N]  (value not drawn)  (masked out: inside a compile mask, not in the netlist)
C_toCap  GRM188Z71C475KE21D  [CAPC1608X90N]  (value not drawn)  (masked out: inside a compile mask, not in the netlist)
C_XTAL_0  C0603C180F8HACAUTO  [C0603]  (masked out: inside a compile mask, not in the netlist)
C_XTAL_1  C0603C180F8HACAUTO  [C0603]  (masked out: inside a compile mask, not in the netlist)
ETH  JXD7-0V06NL  [JXD70V06NL]  (masked out: inside a compile mask, not in the netlist)
IC_ETH  W5500  [QFP50P900X900X160-48N]  (masked out: inside a compile mask, not in the netlist)
R0A  CRCW060310K0FKEB  [RESC1608X50N]  (value not drawn)  (masked out: inside a compile mask, not in the netlist)
R0B  CRCW060310K0FKEB  [RESC1608X50N]  (value not drawn)  (masked out: inside a compile mask, not in the netlist)
R1A  CRCW060310K0FKEB  [RESC1608X50N]  (value not drawn)  (masked out: inside a compile mask, not in the netlist)
R1B  CRCW060310K0FKEB  [RESC1608X50N]  (value not drawn)  (masked out: inside a compile mask, not in the netlist)
R2A  CRCW060310K0FKEB  [RESC1608X50N]  (value not drawn)  (masked out: inside a compile mask, not in the netlist)
R2B  CRCW060310K0FKEB  [RESC1608X50N]  (value not drawn)  (masked out: inside a compile mask, not in the netlist)
R20_ETH  MCT06030C5109FP500  [RESC1608X55N]  (masked out: inside a compile mask, not in the netlist)
R21_ETH  MCT06030C5109FP500  [RESC1608X55N]  (masked out: inside a compile mask, not in the netlist)
R22_ETH  CRCW060310R0FKEAHP  [RESC1608X50N]  (masked out: inside a compile mask, not in the netlist)
R23_ETH  CRCW060382R0FKEA  [RESC1608X50N]  (value not drawn)  (masked out: inside a compile mask, not in the netlist)
R24_ETH  CRCW060382R0FKEA  [RESC1608X50N]  (value not drawn)  (masked out: inside a compile mask, not in the netlist)
R_EXRES  CRCW060312K4FKEB  [RESC1608X50N]  (masked out: inside a compile mask, not in the netlist)
R_GREEN  RN73H1JTTD1002F50  [RESC1608X55N]  (value not drawn)  (masked out: inside a compile mask, not in the netlist)
R_XTAL  ERJ-UP3F1004V  [ERJUP3]  (masked out: inside a compile mask, not in the netlist)
R_YELLOW  RN73H1JTTD1002F50  [RESC1608X55N]  (value not drawn)  (masked out: inside a compile mask, not in the netlist)
Rint  CRCW060310K0FKEB  [RESC1608X50N]  (value not drawn)  (masked out: inside a compile mask, not in the netlist)
Rscs  CRCW060310K0FKEB  [RESC1608X50N]  (value not drawn)  (masked out: inside a compile mask, not in the netlist)
Rstn  CRCW060310K0FKEB  [RESC1608X50N]  (value not drawn)  (masked out: inside a compile mask, not in the netlist)
Rsvd  CRCW060310K0FKEB  [RESC1608X50N]  (value not drawn)  (masked out: inside a compile mask, not in the netlist)
Rsvd2  CRCW060310K0FKEB  [RESC1608X50N]  (value not drawn)  (masked out: inside a compile mask, not in the netlist)
Rsvd3  CRCW060310K0FKEB  [RESC1608X50N]  (value not drawn)  (masked out: inside a compile mask, not in the netlist)
Rsvd4  CRCW060310K0FKEB  [RESC1608X50N]  (value not drawn)  (masked out: inside a compile mask, not in the netlist)
Rsvd5  CRCW060310K0FKEB  [RESC1608X50N]  (value not drawn)  (masked out: inside a compile mask, not in the netlist)
Rsvd6  CRCW060310K0FKEB  [RESC1608X50N]  (value not drawn)  (masked out: inside a compile mask, not in the netlist)
XTAL_ETH  ECS-250-18-4X-CKM  [ECS250184XCKM]  (masked out: inside a compile mask, not in the netlist)

### Ports
MISO (out), MOSI (in), SCLK (in), VDD (in)

### Library data of the parts
C7_ETH C_ETH0 C_ETH1 = C0603C104K8RAC: Capacitor; Manufacturer_Name: KEMET; Datasheet Link: https://www.kemet.com/specsheet/C0603C104K8RAC%7BBULK%7D; Height: 0.95mm; Manufacturer_Part_Number: C0603C104K8RAC; Mouser Part Number: 80-C0603C104K8RAC; Mouser Price/Stock: https://www.mouser.co.uk/ProductDetail/KEMET/C0603C104K8RAC?qs=JxH5GSBHSCStdUs4AtW0Gg%3D%3D; Arrow Part Number: C0603C104K8RAC; Arrow Price/Stock: https://www.arrow.com/en/products/c0603c104k8rac/kemet-corporation?region=nac
C8_ETH = 0603YC223JAT2A: Capacitor; Manufacturer_Name: AVX; Datasheet Link: https://componentsearchengine.com/Datasheets/1/06031A100FAT2A.pdf; Height: 0.9mm; Manufacturer_Part_Number: 0603YC223JAT2A; Mouser Part Number: 581-0603YC223JAT2A; Mouser Price/Stock: https://www.mouser.com/Search/Refine.aspx?Keyword=581-0603YC223JAT2A; Arrow Part Number: 0603YC223JAT2A; Arrow Price/Stock: https://www.arrow.com/en/products/0603yc223jat2a/avx
C9_ETH C10_ETH = C0603C682J3GACAUTO: Capacitor; Manufacturer_Name: KEMET; Datasheet Link: https://content.kemet.com/datasheets/KEM_C1022_C0G_AUTO_SMD.pdf; Height: 0.87mm; Manufacturer_Part_Number: C0603C682J3GACAUTO; Mouser Part Number: 80-C0603C682J3GAUTO; Mouser Price/Stock: https://www.mouser.co.uk/ProductDetail/KEMET/C0603C682J3GACAUTO?qs=hzBznG4dWXWbYOO7wTvwnw%3D%3D
C11_ETH C_ETH4 = CGA3E2C0G1H103J080AA: Capacitor; Manufacturer_Name: TDK; Datasheet Link: https://product.tdk.com/system/files/dam/doc/product/capacitor/ceramic/mlcc/catalog/mlcc_automotive_general_en.pdf; Height: 0.9mm; Manufacturer_Part_Number: CGA3E2C0G1H103J080AA; Mouser Part Number: 810-CGA3E2C0G1H103J; Mouser Price/Stock: https://www.mouser.co.uk/ProductDetail/TDK/CGA3E2C0G1H103J080AA?qs=FxQuwy19cyDZbtgsz1Zj3w%3D%3D; Arrow Part Number: CGA3E2C0G1H103J080AA; Arrow Price/Stock: https://www.arrow.com/en/products/cga3e2c0g1h103j080aa/tdk
C_toCap = GRM188Z71C475KE21D: Capacitor; Manufacturer_Name: Murata Electronics; Height: 0.9mm; Manufacturer_Part_Number: GRM188Z71C475KE21D; Mouser Part Number: 81-GRM188Z71C475KE1D; Mouser Price/Stock: https://www.mouser.co.uk/ProductDetail/Murata-Electronics/GRM188Z71C475KE21D?qs=d0WKAl%252BL4KajNOvalhHKtQ%3D%3D; Arrow Part Number: GRM188Z71C475KE21D; Arrow Price/Stock: https://www.arrow.com/en/products/grm188z71c475ke21d/murata-manufacturing?region=europe
C_XTAL_0 C_XTAL_1 = C0603C180F8HACAUTO: Capacitor; Manufacturer_Name: KEMET; Datasheet Link: https://content.kemet.com/datasheets/KEM_C1007_X8R_ULTRA_150C_SMD.pdf; Height: 0.87mm; Manufacturer_Part_Number: C0603C180F8HACAUTO; Mouser Part Number: 80-C0603C180F8HAUTO; Mouser Price/Stock: https://www.mouser.co.uk/ProductDetail/KEMET/C0603C180F8HACAUTO?qs=j%252B1pi9TdxUYBmkMIwopXuQ%3D%3D
ETH = JXD7-0V06NL: Connector; Manufacturer_Name: Pulse Electronics; Datasheet Link: https://productfinder.pulseelectronics.com/api/open/product-attachments/datasheet/jxd7-0v06nl; Height: 13.75mm; Manufacturer_Part_Number: JXD7-0V06NL; Mouser Part Number: 673-JXD7-0V06NL; Mouser Price/Stock: https://www.mouser.co.uk/ProductDetail/Pulse-Electronics/JXD7-0V06NL?qs=tlsG%2FOw5FFh4BJdtxVEWnw%3D%3D
IC_ETH = W5500: Integrated Circuit; Manufacturer_Name: WIZnet Inc; Datasheet Link: http://wizwiki.net/wiki/lib/exe/fetch.php?media=products:w5500:w5500_ds_v106e_141230.pdf; Height: 1.6mm; Manufacturer_Part_Number: W5500; Mouser Part Number: 950-W5500; Mouser Price/Stock: https://www.mouser.co.uk/ProductDetail/WIZnet/W5500?qs=2vh%252B45pPFtzthUpYPd4pqA%3D%3D
R0A R0B R1A R1B R2A R2B Rint Rscs Rstn Rsvd Rsvd2-Rsvd6 = CRCW060310K0FKEB: Resistor; Manufacturer_Name: Vishay; Datasheet Link: http://www.vishay.com/docs/20035/dcrcwe3.pdf; Height: 0.5mm; Manufacturer_Part_Number: CRCW060310K0FKEB; Mouser Part Number: 71-CRCW060310K0FKEB; Mouser Price/Stock: https://www.mouser.co.uk/ProductDetail/Vishay-Dale/CRCW060310K0FKEB?qs=KP%252BPudsHLdyVfHu6lav4Iw%3D%3D; Arrow Part Number: CRCW060310K0FKEB; Arrow Price/Stock: https://www.arrow.com/en/products/crcw060310k0fkeb/vishay
R20_ETH R21_ETH = MCT06030C5109FP500: Resistor; Manufacturer_Name: Vishay; Datasheet Link: http://www.vishay.com/docs/28705/mcx0x0xpro.pdf; Height: 0.55mm; Manufacturer_Part_Number: MCT06030C5109FP500; Mouser Part Number: 594-MCT06030C5109FP5; Mouser Price/Stock: https://www.mouser.co.uk/ProductDetail/Vishay-Beyschlag/MCT06030C5109FP500?qs=hjSuqQECij8uzjowOg4JiA%3D%3D; Arrow Part Number: MCT06030C5109FP500; Arrow Price/Stock: https://www.arrow.com/en/products/mct06030c5109fp500/vishay?region=nac
R22_ETH = CRCW060310R0FKEAHP: Resistor; Manufacturer_Name: Vishay; Datasheet Link: http://www.farnell.com/datasheets/1885357.pdf; Height: 0.5mm; Manufacturer_Part_Number: CRCW060310R0FKEAHP; Mouser Part Number: 71-CRCW060310R0FKEAH; Mouser Price/Stock: https://www.mouser.co.uk/ProductDetail/Vishay-Dale/CRCW060310R0FKEAHP?qs=k2%2FDWSARqgHKJ7AdmQKyZw%3D%3D; Arrow Part Number: CRCW060310R0FKEAHP; Arrow Price/Stock: https://www.arrow.com/en/products/crcw060310r0fkeahp/vishay?region=nac
R23_ETH R24_ETH = CRCW060382R0FKEA: Resistor; Manufacturer_Name: Vishay; Datasheet Link: http://www.vishay.com/docs/20035/dcrcwe3.pdf; Height: 0.5mm; Manufacturer_Part_Number: CRCW060382R0FKEA; Mouser Part Number: 71-CRCW0603-82-E3; Mouser Price/Stock: https://www.mouser.co.uk/ProductDetail/Vishay-Dale/CRCW060382R0FKEA?qs=5rGgbCH0pB18%252BT0VmwhFKg%3D%3D
R_EXRES = CRCW060312K4FKEB: Resistor; Manufacturer_Name: Vishay; Datasheet Link: http://www.vishay.com/docs/20035/dcrcwe3.pdf; Height: 0.5mm; Manufacturer_Part_Number: CRCW060312K4FKEB; Mouser Part Number: 71-CRCW060312K4FKEB; Mouser Price/Stock: https://www.mouser.co.uk/ProductDetail/Vishay-Dale/CRCW060312K4FKEB?qs=FjnTi%2FStZU%2F2feO3GcoFXQ%3D%3D
R_GREEN R_YELLOW = RN73H1JTTD1002F50: Resistor; Manufacturer_Name: KOA Speer; Datasheet Link: https://www.koaglobal.com/-/media/Files/KOA_Global/EN/product/commonpdf/rn73h.pdf; Height: 0.55mm; Manufacturer_Part_Number: RN73H1JTTD1002F50; Mouser Part Number: 660-RN73H1JTD1002F50; Mouser Price/Stock: https://www.mouser.co.uk/ProductDetail/KOA-Speer/RN73H1JTTD1002F50?qs=0hon8nwgHrYkULp4meknmQ%3D%3D
R_XTAL = ERJ-UP3F1004V: Resistor; Manufacturer_Name: Panasonic; Datasheet Link: https://industrial.panasonic.com/cdbs/www-data/pdf/RDP0000/AOA0000C337.pdf; Height: 0.55mm; Manufacturer_Part_Number: ERJ-UP3F1004V; Mouser Part Number: 667-ERJ-UP3F1004V; Mouser Price/Stock: https://www.mouser.co.uk/ProductDetail/Panasonic/ERJ-UP3F1004V?qs=GedFDFLaBXE3dX6ROfhlog%3D%3D; Arrow Part Number: ERJ-UP3F1004V; Arrow Price/Stock: https://www.arrow.com/en/products/erj-up3f1004v/panasonic?region=nac
XTAL_ETH = ECS-250-18-4X-CKM: Crystal or Oscillator; Manufacturer_Name: ECS; Datasheet Link: https://www.arrow.com/en/products/ecs-250-18-4x-ckm/ecs-international; Height: 3.5mm; Manufacturer_Part_Number: ECS-250-18-4X-CKM; Mouser Part Number: 520-ECS250-18-4X-CKM; Mouser Price/Stock: https://www.mouser.co.uk/ProductDetail/ECS/ECS-250-18-4X-CKM?qs=7MVldsJ5UaxHIC%2FWkVVFMA%3D%3D; Arrow Part Number: ECS-250-18-4X-CKM; Arrow Price/Stock: https://www.arrow.com/en/products/ecs-250-18-4x-ckm/ecs-international?region=nac

## Sheet CPU_and_EXPANSION_BUS.SchDoc
size A0; SheetNumber: 5; SheetTotal: 12
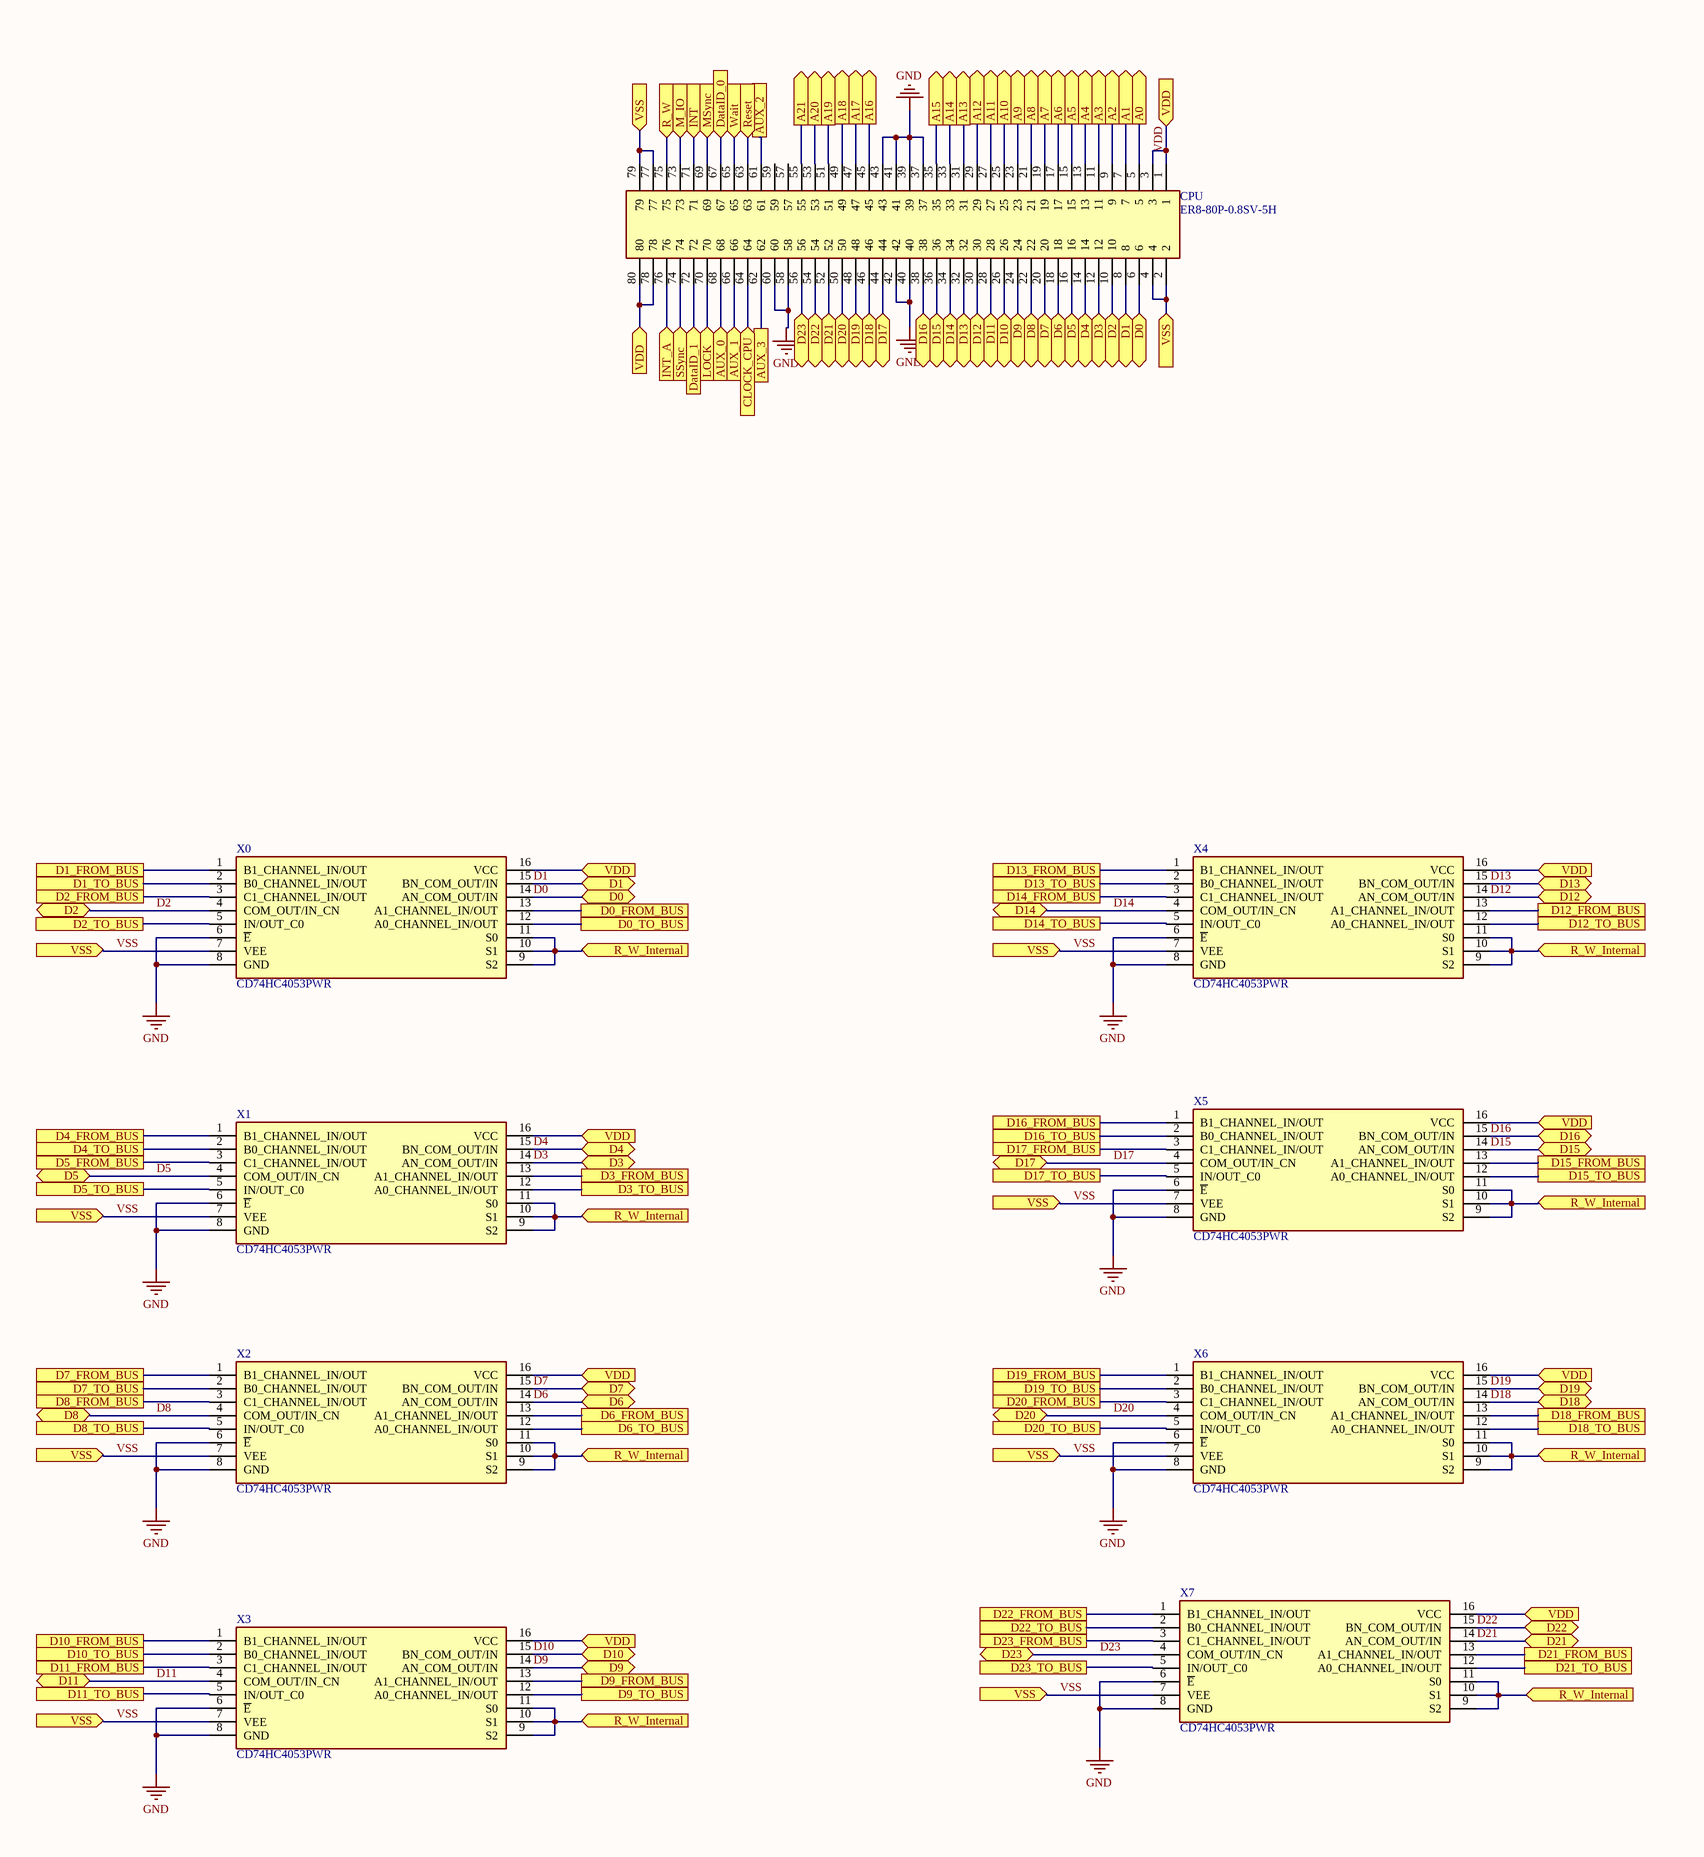
[diagram p5: CPU_and_EXPANSION_BUS.SchDoc, left]
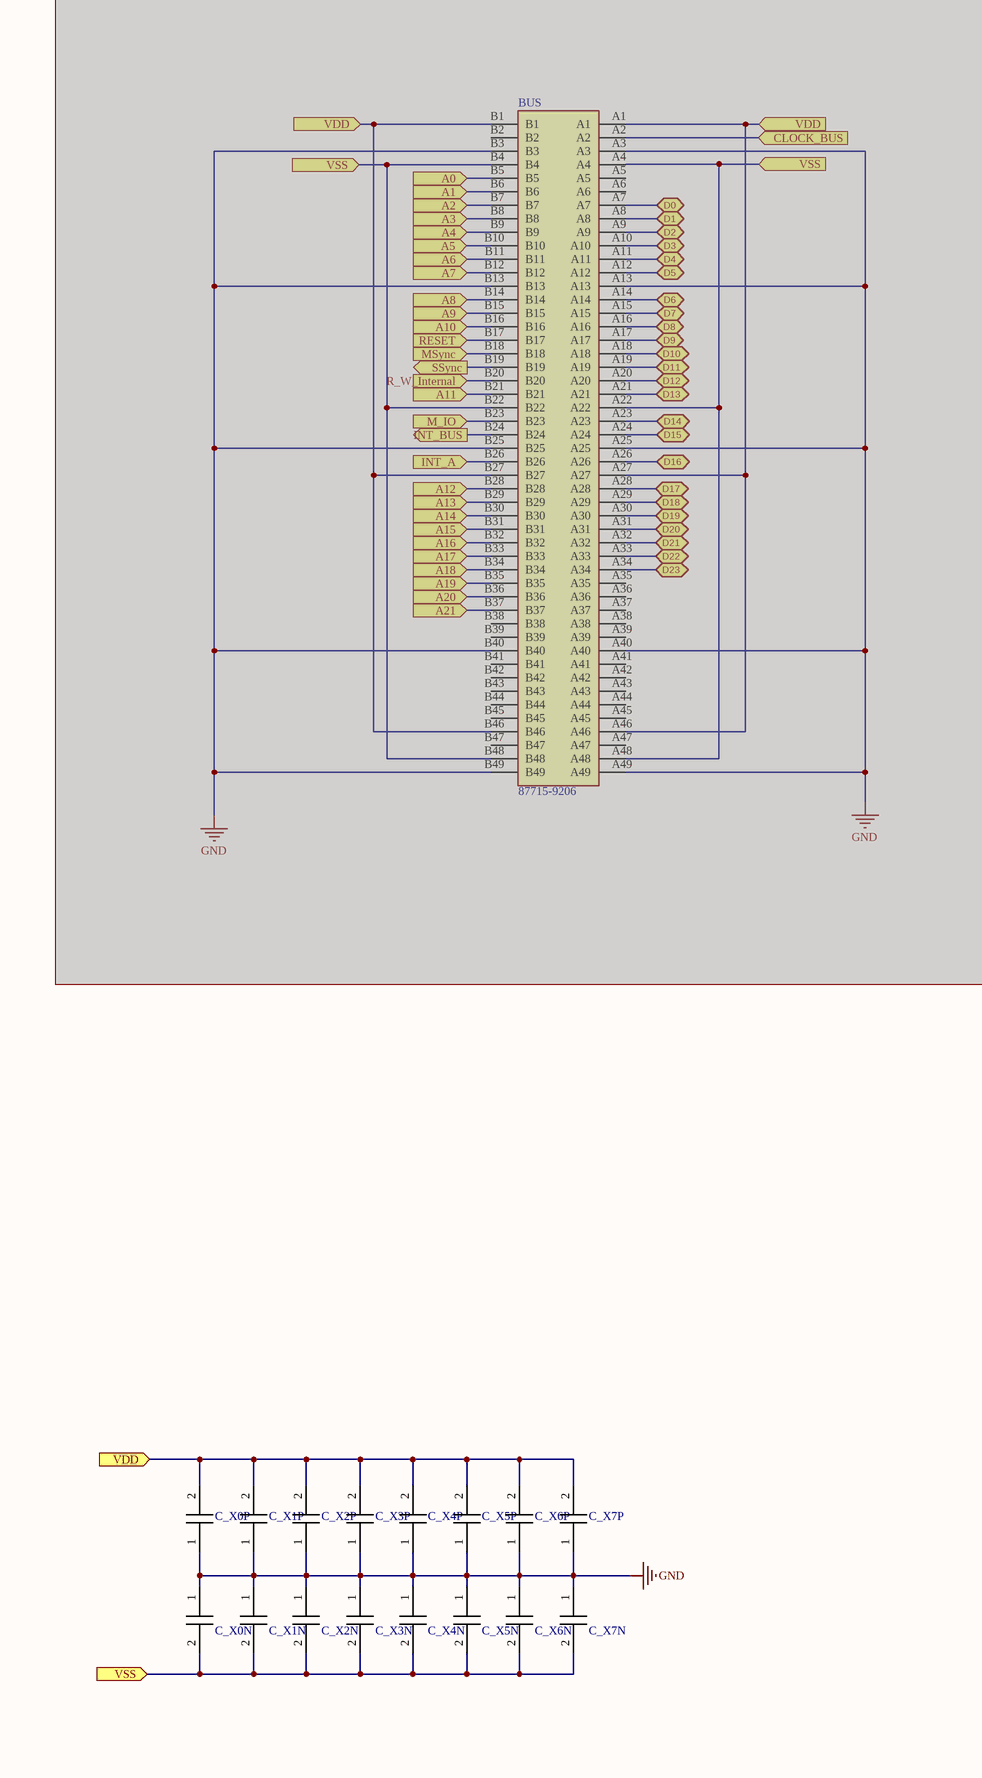
[diagram p6: CPU_and_EXPANSION_BUS.SchDoc, right]

### Parts
BUS  87715-9206  [877159206]  (masked out: inside a compile mask, not in the netlist)
C_X0N  GRM155R71C104JA88J  [CAPC1005X55N]  (value not drawn)
C_X0P  GRM155R71C104JA88J  [CAPC1005X55N]  (value not drawn)
C_X1N  GRM155R71C104JA88J  [CAPC1005X55N]  (value not drawn)
C_X1P  GRM155R71C104JA88J  [CAPC1005X55N]  (value not drawn)
C_X2N  GRM155R71C104JA88J  [CAPC1005X55N]  (value not drawn)
C_X2P  GRM155R71C104JA88J  [CAPC1005X55N]  (value not drawn)
C_X3N  GRM155R71C104JA88J  [CAPC1005X55N]  (value not drawn)
C_X3P  GRM155R71C104JA88J  [CAPC1005X55N]  (value not drawn)
C_X4N  GRM155R71C104JA88J  [CAPC1005X55N]  (value not drawn)
C_X4P  GRM155R71C104JA88J  [CAPC1005X55N]  (value not drawn)
C_X5N  GRM155R71C104JA88J  [CAPC1005X55N]  (value not drawn)
C_X5P  GRM155R71C104JA88J  [CAPC1005X55N]  (value not drawn)
C_X6N  GRM155R71C104JA88J  [CAPC1005X55N]  (value not drawn)
C_X6P  GRM155R71C104JA88J  [CAPC1005X55N]  (value not drawn)
C_X7N  GRM155R71C104JA88J  [CAPC1005X55N]  (value not drawn)
C_X7P  GRM155R71C104JA88J  [CAPC1005X55N]  (value not drawn)
CPU  ER8-80P-0.8SV-5H  [ER880P08SV5H]
X0  CD74HC4053PWR  [SOP65P640X120-16N]
X1  CD74HC4053PWR  [SOP65P640X120-16N]
X2  CD74HC4053PWR  [SOP65P640X120-16N]
X3  CD74HC4053PWR  [SOP65P640X120-16N]
X4  CD74HC4053PWR  [SOP65P640X120-16N]
X5  CD74HC4053PWR  [SOP65P640X120-16N]
X6  CD74HC4053PWR  [SOP65P640X120-16N]
X7  CD74HC4053PWR  [SOP65P640X120-16N]

### Ports
A0 (in), A0 (out), A1 (in), A1 (out), A2 (in), A2 (out), A3 (in), A3 (out), A4 (in), A4 (out), A5 (in), A5 (out), A6 (in), A6 (out), A7 (in), A7 (out), A8 (in), A8 (out), A9 (in), A9 (out), A10 (in), A10 (out), A11 (in), A11 (out), A12 (in), A12 (out), A13 (in), A13 (out), A14 (in), A14 (out), A15 (in), A15 (out), A16 (in), A16 (out), A17 (in), A17 (out), A18 (in), A18 (out), A19 (in), A19 (out), A20 (in), A20 (out), A21 (in), A21 (out), AUX_0 (in), AUX_1 (in), AUX_2, AUX_3, CLOCK_BUS (in), CLOCK_CPU (in), D0 (bidir), D0_FROM_BUS, D0_TO_BUS, D1 (bidir), D1_FROM_BUS, D1_TO_BUS, D2 (bidir), D2_FROM_BUS, D2_TO_BUS, D3 (bidir), D3_FROM_BUS, D3_TO_BUS, D4 (bidir), D4_FROM_BUS, D4_TO_BUS, D5 (bidir), D5_FROM_BUS, D5_TO_BUS, D6 (bidir), D6_FROM_BUS, D6_TO_BUS, D7 (bidir), D7_FROM_BUS, D7_TO_BUS, D8 (bidir), D8_FROM_BUS, D8_TO_BUS, D9 (bidir), D9_FROM_BUS, D9_TO_BUS, D10 (bidir), D10_FROM_BUS, D10_TO_BUS, D11 (bidir), D11_FROM_BUS, D11_TO_BUS, D12 (bidir), D12_FROM_BUS, D12_TO_BUS, D13 (bidir), D13_FROM_BUS, D13_TO_BUS, D14 (bidir), D14_FROM_BUS, D14_TO_BUS, D15 (bidir), D15_FROM_BUS, D15_TO_BUS, D16 (bidir), D16_FROM_BUS, D16_TO_BUS, D17 (bidir), D17_FROM_BUS, D17_TO_BUS, D18 (bidir), D18_FROM_BUS, D18_TO_BUS, D19 (bidir), D19_FROM_BUS, D19_TO_BUS, D20 (bidir), D20_FROM_BUS, D20_TO_BUS, D21 (bidir), D21_FROM_BUS, D21_TO_BUS, D22 (bidir), D22_FROM_BUS, D22_TO_BUS, D23 (bidir), D23_FROM_BUS, D23_TO_BUS, DataID_0 (in), DataID_1 (in), INT (in), INT_A (in), INT_BUS (out), LOCK (in), M_IO (in), MSync (in), R_W (in), R_W_Internal (in), Reset (in), RESET (in), SSync (in), SSync (out), VDD (in), VSS (in), Wait (in)

### Nets
GND: C_X0N.1 C_X0P.1 C_X1N.1 C_X1P.1 C_X2N.1 C_X2P.1 C_X3N.1 C_X3P.1 C_X4N.1 C_X4P.1 C_X5N.1 C_X5P.1 C_X6N.1 C_X6P.1 C_X7N.1 C_X7P.1 CPU.37 CPU.39 CPU.40 CPU.41 CPU.42 CPU.43 CPU.58 CPU.60 X0.6(~{E}) X0.8(GND) X1.6(~{E}) X1.8(GND) X2.6(~{E}) X2.8(GND) X3.6(~{E}) X3.8(GND) X4.6(~{E}) X4.8(GND) X5.6(~{E}) X5.8(GND) X6.6(~{E}) X6.8(GND) X7.6(~{E}) X7.8(GND)
A0: CPU.5 ; port A0
A1: CPU.7 ; port A1
A2: CPU.9 ; port A2
A3: CPU.11 ; port A3
A4: CPU.13 ; port A4
A5: CPU.15 ; port A5
A6: CPU.17 ; port A6
A7: CPU.19 ; port A7
A8: CPU.21 ; port A8
A9: CPU.23 ; port A9
A10: CPU.25 ; port A10
A11: CPU.27 ; port A11
A12: CPU.29 ; port A12
A13: CPU.31 ; port A13
A14: CPU.33 ; port A14
A15: CPU.35 ; port A15
A16: CPU.45 ; port A16
A17: CPU.47 ; port A17
A18: CPU.49 ; port A18
A19: CPU.51 ; port A19
A20: CPU.53 ; port A20
A21: CPU.55 ; port A21
AUX_0: CPU.68 ; port AUX_0
AUX_1: CPU.66 ; port AUX_1
AUX_2: CPU.61 ; port AUX_2
AUX_3: CPU.62 ; port AUX_3
Clock_CPU: CPU.64 ; port CLOCK_CPU
D0: CPU.6 X0.14(AN_COM_OUT/IN) ; port D0
D0_FROM_BUS: X0.13(A1_CHANNEL_IN/OUT) ; port D0_FROM_BUS
D0_TO_BUS: X0.12(A0_CHANNEL_IN/OUT) ; port D0_TO_BUS
D1: CPU.8 X0.15(BN_COM_OUT/IN) ; port D1
D1_FROM_BUS: X0.1(B1_CHANNEL_IN/OUT) ; port D1_FROM_BUS
D1_TO_BUS: X0.2(B0_CHANNEL_IN/OUT) ; port D1_TO_BUS
D2: CPU.10 X0.4(COM_OUT/IN_CN) ; port D2
D2_FROM_BUS: X0.3(C1_CHANNEL_IN/OUT) ; port D2_FROM_BUS
D2_TO_BUS: X0.5(IN/OUT_C0) ; port D2_TO_BUS
D3: CPU.12 X1.14(AN_COM_OUT/IN) ; port D3
D3_FROM_BUS: X1.13(A1_CHANNEL_IN/OUT) ; port D3_FROM_BUS
D3_TO_BUS: X1.12(A0_CHANNEL_IN/OUT) ; port D3_TO_BUS
D4: CPU.14 X1.15(BN_COM_OUT/IN) ; port D4
D4_FROM_BUS: X1.1(B1_CHANNEL_IN/OUT) ; port D4_FROM_BUS
D4_TO_BUS: X1.2(B0_CHANNEL_IN/OUT) ; port D4_TO_BUS
D5: CPU.16 X1.4(COM_OUT/IN_CN) ; port D5
D5_FROM_BUS: X1.3(C1_CHANNEL_IN/OUT) ; port D5_FROM_BUS
D5_TO_BUS: X1.5(IN/OUT_C0) ; port D5_TO_BUS
D6: CPU.18 X2.14(AN_COM_OUT/IN) ; port D6
D6_FROM_BUS: X2.13(A1_CHANNEL_IN/OUT) ; port D6_FROM_BUS
D6_TO_BUS: X2.12(A0_CHANNEL_IN/OUT) ; port D6_TO_BUS
D7: CPU.20 X2.15(BN_COM_OUT/IN) ; port D7
D7_FROM_BUS: X2.1(B1_CHANNEL_IN/OUT) ; port D7_FROM_BUS
D7_TO_BUS: X2.2(B0_CHANNEL_IN/OUT) ; port D7_TO_BUS
D8: CPU.22 X2.4(COM_OUT/IN_CN) ; port D8
D8_FROM_BUS: X2.3(C1_CHANNEL_IN/OUT) ; port D8_FROM_BUS
D8_TO_BUS: X2.5(IN/OUT_C0) ; port D8_TO_BUS
D9: CPU.24 X3.14(AN_COM_OUT/IN) ; port D9
D9_FROM_BUS: X3.13(A1_CHANNEL_IN/OUT) ; port D9_FROM_BUS
D9_TO_BUS: X3.12(A0_CHANNEL_IN/OUT) ; port D9_TO_BUS
D10: CPU.26 X3.15(BN_COM_OUT/IN) ; port D10
D10_FROM_BUS: X3.1(B1_CHANNEL_IN/OUT) ; port D10_FROM_BUS
D10_TO_BUS: X3.2(B0_CHANNEL_IN/OUT) ; port D10_TO_BUS
D11: CPU.28 X3.4(COM_OUT/IN_CN) ; port D11
D11_FROM_BUS: X3.3(C1_CHANNEL_IN/OUT) ; port D11_FROM_BUS
D11_TO_BUS: X3.5(IN/OUT_C0) ; port D11_TO_BUS
D12: CPU.30 X4.14(AN_COM_OUT/IN) ; port D12
D12_FROM_BUS: X4.13(A1_CHANNEL_IN/OUT) ; port D12_FROM_BUS
D12_TO_BUS: X4.12(A0_CHANNEL_IN/OUT) ; port D12_TO_BUS
D13: CPU.32 X4.15(BN_COM_OUT/IN) ; port D13
D13_FROM_BUS: X4.1(B1_CHANNEL_IN/OUT) ; port D13_FROM_BUS
D13_TO_BUS: X4.2(B0_CHANNEL_IN/OUT) ; port D13_TO_BUS
D14: CPU.34 X4.4(COM_OUT/IN_CN) ; port D14
D14_FROM_BUS: X4.3(C1_CHANNEL_IN/OUT) ; port D14_FROM_BUS
D14_TO_BUS: X4.5(IN/OUT_C0) ; port D14_TO_BUS
D15: CPU.36 X5.14(AN_COM_OUT/IN) ; port D15
D15_FROM_BUS: X5.13(A1_CHANNEL_IN/OUT) ; port D15_FROM_BUS
D15_TO_BUS: X5.12(A0_CHANNEL_IN/OUT) ; port D15_TO_BUS
D16: CPU.38 X5.15(BN_COM_OUT/IN) ; port D16
D16_FROM_BUS: X5.1(B1_CHANNEL_IN/OUT) ; port D16_FROM_BUS
D16_TO_BUS: X5.2(B0_CHANNEL_IN/OUT) ; port D16_TO_BUS
D17: CPU.44 X5.4(COM_OUT/IN_CN) ; port D17
D17_FROM_BUS: X5.3(C1_CHANNEL_IN/OUT) ; port D17_FROM_BUS
D17_TO_BUS: X5.5(IN/OUT_C0) ; port D17_TO_BUS
D18: CPU.46 X6.14(AN_COM_OUT/IN) ; port D18
D18_FROM_BUS: X6.13(A1_CHANNEL_IN/OUT) ; port D18_FROM_BUS
D18_TO_BUS: X6.12(A0_CHANNEL_IN/OUT) ; port D18_TO_BUS
D19: CPU.48 X6.15(BN_COM_OUT/IN) ; port D19
D19_FROM_BUS: X6.1(B1_CHANNEL_IN/OUT) ; port D19_FROM_BUS
D19_TO_BUS: X6.2(B0_CHANNEL_IN/OUT) ; port D19_TO_BUS
D20: CPU.50 X6.4(COM_OUT/IN_CN) ; port D20
D20_FROM_BUS: X6.3(C1_CHANNEL_IN/OUT) ; port D20_FROM_BUS
D20_TO_BUS: X6.5(IN/OUT_C0) ; port D20_TO_BUS
D21: CPU.52 X7.14(AN_COM_OUT/IN) ; port D21
D21_FROM_BUS: X7.13(A1_CHANNEL_IN/OUT) ; port D21_FROM_BUS
D21_TO_BUS: X7.12(A0_CHANNEL_IN/OUT) ; port D21_TO_BUS
D22: CPU.54 X7.15(BN_COM_OUT/IN) ; port D22
D22_TO_BUS: X7.2(B0_CHANNEL_IN/OUT) ; port D22_TO_BUS
D23: CPU.56 X7.4(COM_OUT/IN_CN) ; port D23
D23_FROM_BUS: X7.3(C1_CHANNEL_IN/OUT) ; port D23_FROM_BUS
D23_TO_BUS: X7.5(IN/OUT_C0) ; port D23_TO_BUS
DataID_0: CPU.67 ; port DataID_0
DataID_1: CPU.72 ; port DataID_1
INT: CPU.71 ; port INT
INT_A: CPU.76 ; port INT_A
LOCK: CPU.70 ; port LOCK
M_IO: CPU.73 ; port M_IO
MSync: CPU.69 ; port MSync
R_W: CPU.75 ; port R_W
R_W_Internal: X0.9(S2) X0.10(S1) X0.11(S0) X1.9(S2) X1.10(S1) X1.11(S0) X2.9(S2) X2.10(S1) X2.11(S0) X3.9(S2) X3.10(S1) X3.11(S0) X4.9(S2) X4.10(S1) X4.11(S0) X5.9(S2) X5.10(S1) X5.11(S0) X6.9(S2) X6.10(S1) X6.11(S0) X7.9(S2) X7.10(S1) X7.11(S0) ; port R_W_Internal
Reset: CPU.63 ; port Reset
SSync: CPU.74 ; port SSync
VDD: C_X0P.2 C_X1P.2 C_X2P.2 C_X3P.2 C_X4P.2 C_X5P.2 C_X6P.2 C_X7P.2 CPU.1 CPU.3 CPU.78 CPU.80 X0.16(VCC) X1.16(VCC) X2.16(VCC) X3.16(VCC) X4.16(VCC) X5.16(VCC) X6.16(VCC) X7.16(VCC) ; port VDD
VSS: C_X0N.2 C_X1N.2 C_X2N.2 C_X3N.2 C_X4N.2 C_X5N.2 C_X6N.2 C_X7N.2 CPU.2 CPU.4 CPU.77 CPU.79 X0.7(VEE) X1.7(VEE) X2.7(VEE) X3.7(VEE) X4.7(VEE) X5.7(VEE) X6.7(VEE) X7.7(VEE) ; port VSS
Wait: CPU.65 ; port Wait
NetQD_22_1: X7.1(B1_CHANNEL_IN/OUT) ; port D22_FROM_BUS

Not connected (* = marked no-connect by the designer): CPU 57 59

### Library data of the parts
BUS = 87715-9206: Connector; Manufacturer_Name: Molex; Datasheet Link: https://www.molex.com/pdm_docs/sd/877159100_sd.pdf; Height: 11.25mm; Manufacturer_Part_Number: 87715-9206; Mouser Part Number: 538-87715-9206; Mouser Price/Stock: https://www.mouser.co.uk/ProductDetail/Molex/87715-9206?qs=ei%2FvZTf36ZzJMI14HVKIJA%3D%3D
C_X0N C_X0P C_X1N C_X1P C_X2N C_X2P C_X3N C_X3P C_X4N C_X4P C_X5N C_X5P C_X6N C_X6P C_X7N C_X7P = GRM155R71C104JA88J: as C_PLL on sheet Power; Datasheet Link: https://datasheet.datasheetarchive.com/originals/distributors/DKDS-10/191304.pdf; Height: 0.55mm; Manufacturer_Part_Number: GRM155R71C104JA88J; Mouser Part Number: 81-GRM155R71C104JA8J; Mouser Price/Stock: https://www.mouser.co.uk/ProductDetail/Murata-Electronics/GRM155R71C104JA88J?qs=hNud%2FORuBR1FShEh%252B0yzMw%3D%3D; Arrow Part Number: GRM155R71C104JA88J; Arrow Price/Stock: https://www.arrow.com/en/products/grm155r71c104ja88j/murata-manufacturing?region=nac
CPU = ER8-80P-0.8SV-5H: Connector; Manufacturer_Name: Hirose; Datasheet Link: https://datasheet.datasheetarchive.com/originals/distributors/DKDS-30/592323.pdf; Height: 8.905mm; Manufacturer_Part_Number: ER8-80P-0.8SV-5H; Mouser Part Number: 798-ER8-80P-0.8SV-5H; Mouser Price/Stock: https://www.mouser.com/Search/Refine.aspx?Keyword=798-ER8-80P-0.8SV-5H
X0-X7 = CD74HC4053PWR: Integrated Circuit; Manufacturer_Name: Texas Instruments; Datasheet Link: http://www.ti.com/lit/gpn/cd74hc4053; Height: 1.2mm; Manufacturer_Part_Number: CD74HC4053PWR; Mouser Part Number: 595-CD74HC4053PWR; Mouser Price/Stock: https://www.mouser.co.uk/ProductDetail/Texas-Instruments/CD74HC4053PWR?qs=DXdcjUGny5N%252BxCpA7Ml8gA%3D%3D; Arrow Part Number: CD74HC4053PWR; Arrow Price/Stock: https://www.arrow.com/en/products/cd74hc4053pwr/texas-instruments